# EAGLE schematic Cynara Viride (EAGLE 7.5.0)
BOARD1: PC1200; CDS: © 2015 Sioux Embedded Systems bv, Eindhoven, The Netherlands; DATE1: 010112; REM1: SaSc/initial design; REV1: 1.0

## Sheet 1 of 9: License
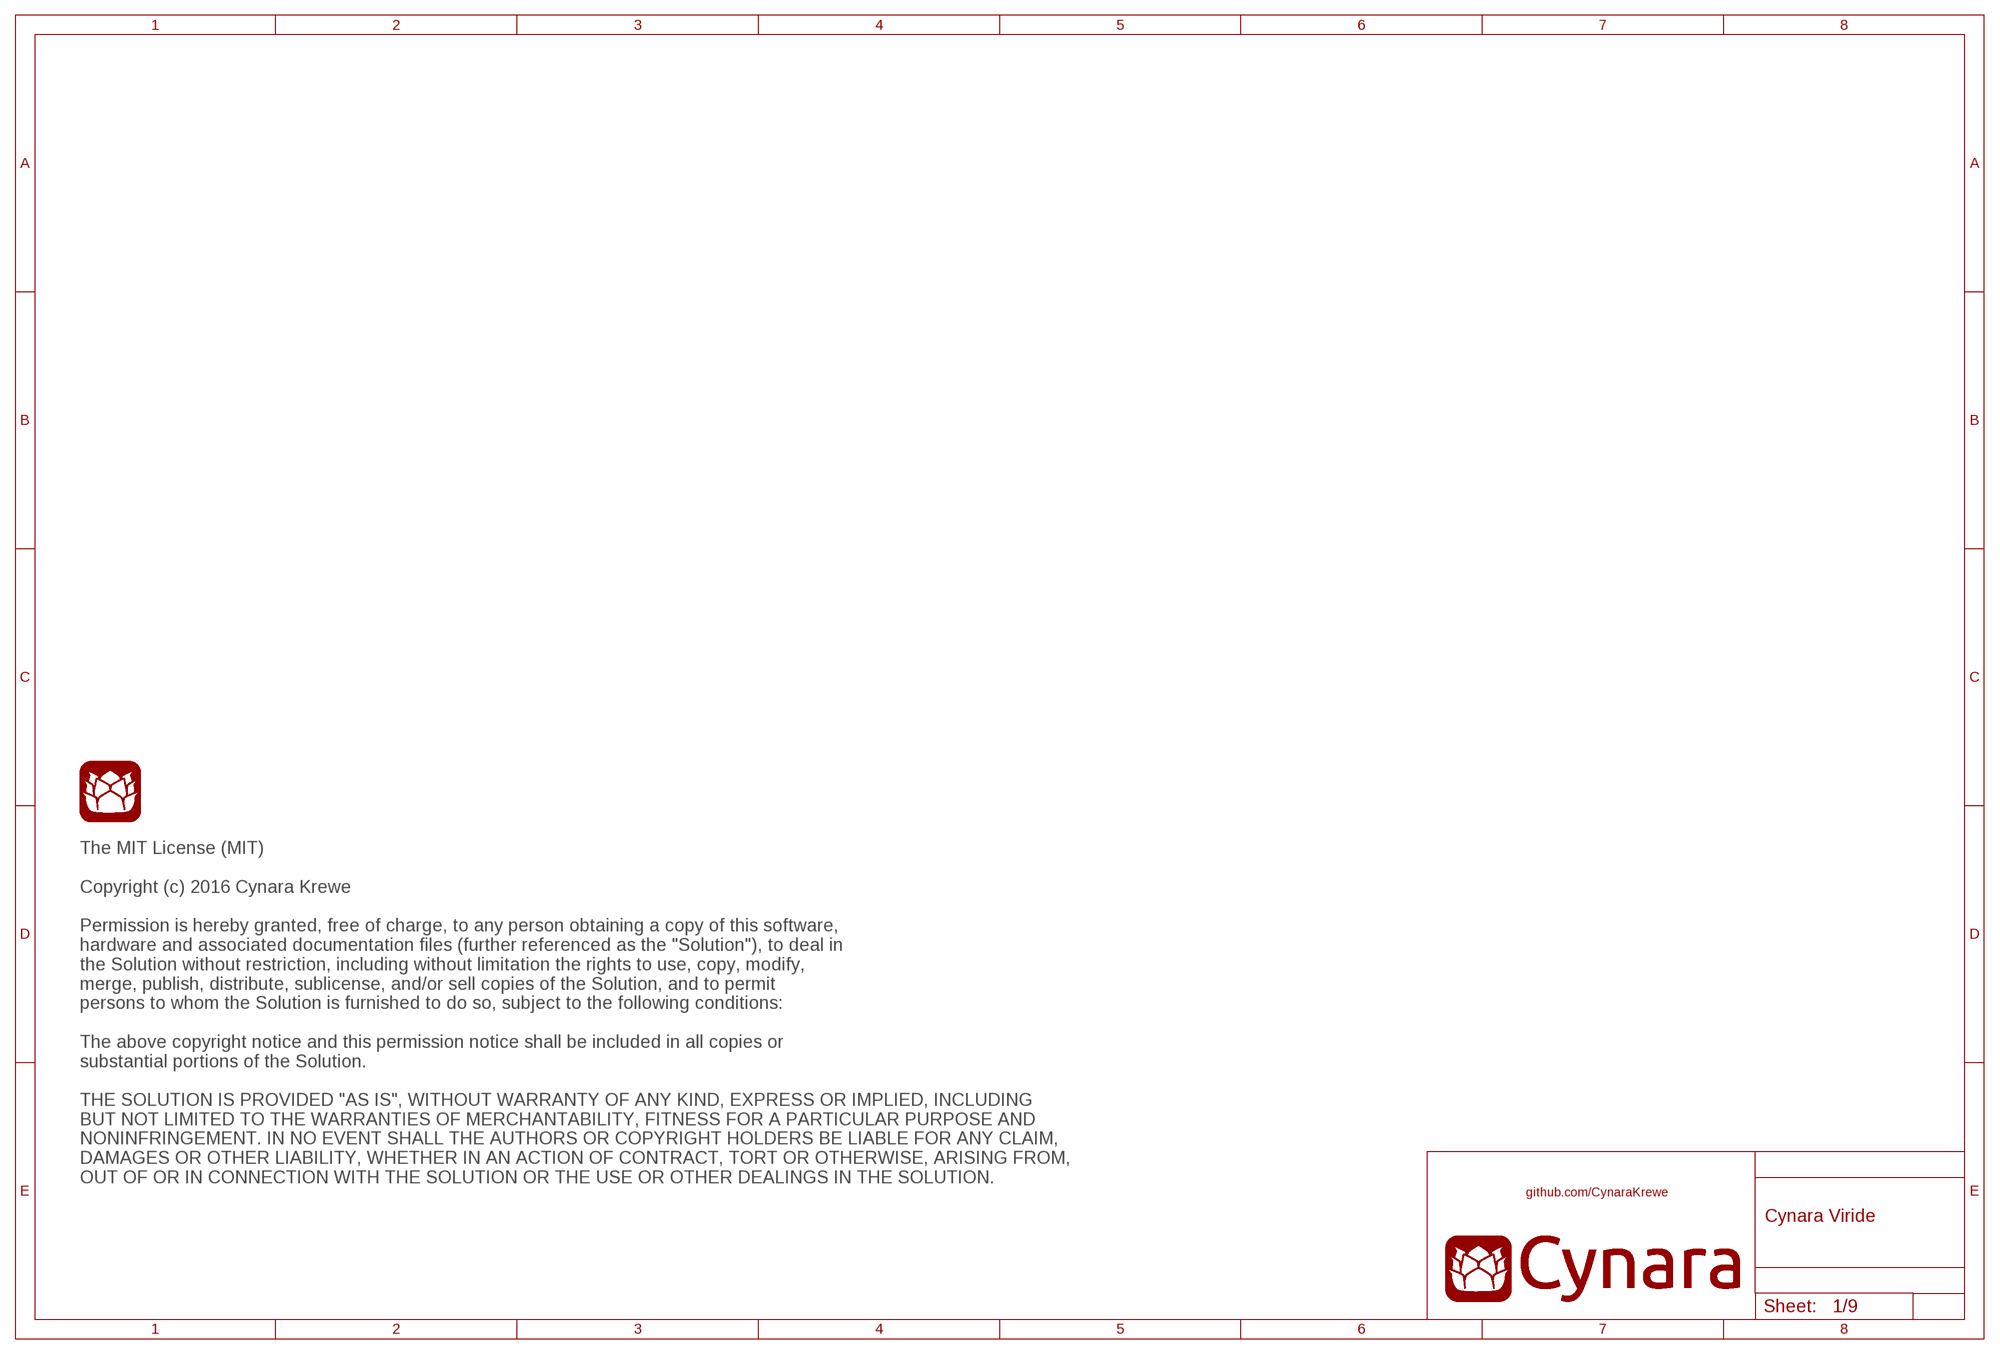
[diagram p0: schematic, sheet 1]

### Parts
U$21  CYNARA_FRONT  [CYNARA_BELOW_W15MM]

### Notes on the sheet
- The MIT License (MIT)
  
  Copyright (c) 2016 Cynara Krewe
  
  Permission is hereby granted, free of charge, to any person obtaining a copy of this software, 
  hardware and associated documentation files (further referenced as the "Solution"), to deal in 
  the Solution without restriction, including without limitation the rights to use, copy, modify, 
  merge, publish, distribute, sublicense, and/or sell copies of the Solution, and to permit 
  persons to whom the Solution is furnished to do so, subject to the following conditions:
  
  The above copyright notice and this permission notice shall be included in all copies or 
  substantial portions of the Solution.
  
  THE SOLUTION IS PROVIDED "AS IS", WITHOUT WARRANTY OF ANY KIND, EXPRESS OR IMPLIED, INCLUDING 
  BUT NOT LIMITED TO THE WARRANTIES OF MERCHANTABILITY, FITNESS FOR A PARTICULAR PURPOSE AND 
  NONINFRINGEMENT. IN NO EVENT SHALL THE AUTHORS OR COPYRIGHT HOLDERS BE LIABLE FOR ANY CLAIM, 
  DAMAGES OR OTHER LIABILITY, WHETHER IN AN ACTION OF CONTRACT, TORT OR OTHERWISE, ARISING FROM, 
  OUT OF OR IN CONNECTION WITH THE SOLUTION OR THE USE OR OTHER DEALINGS IN THE SOLUTION.

## Sheet 2 of 9: MCU: IO pins
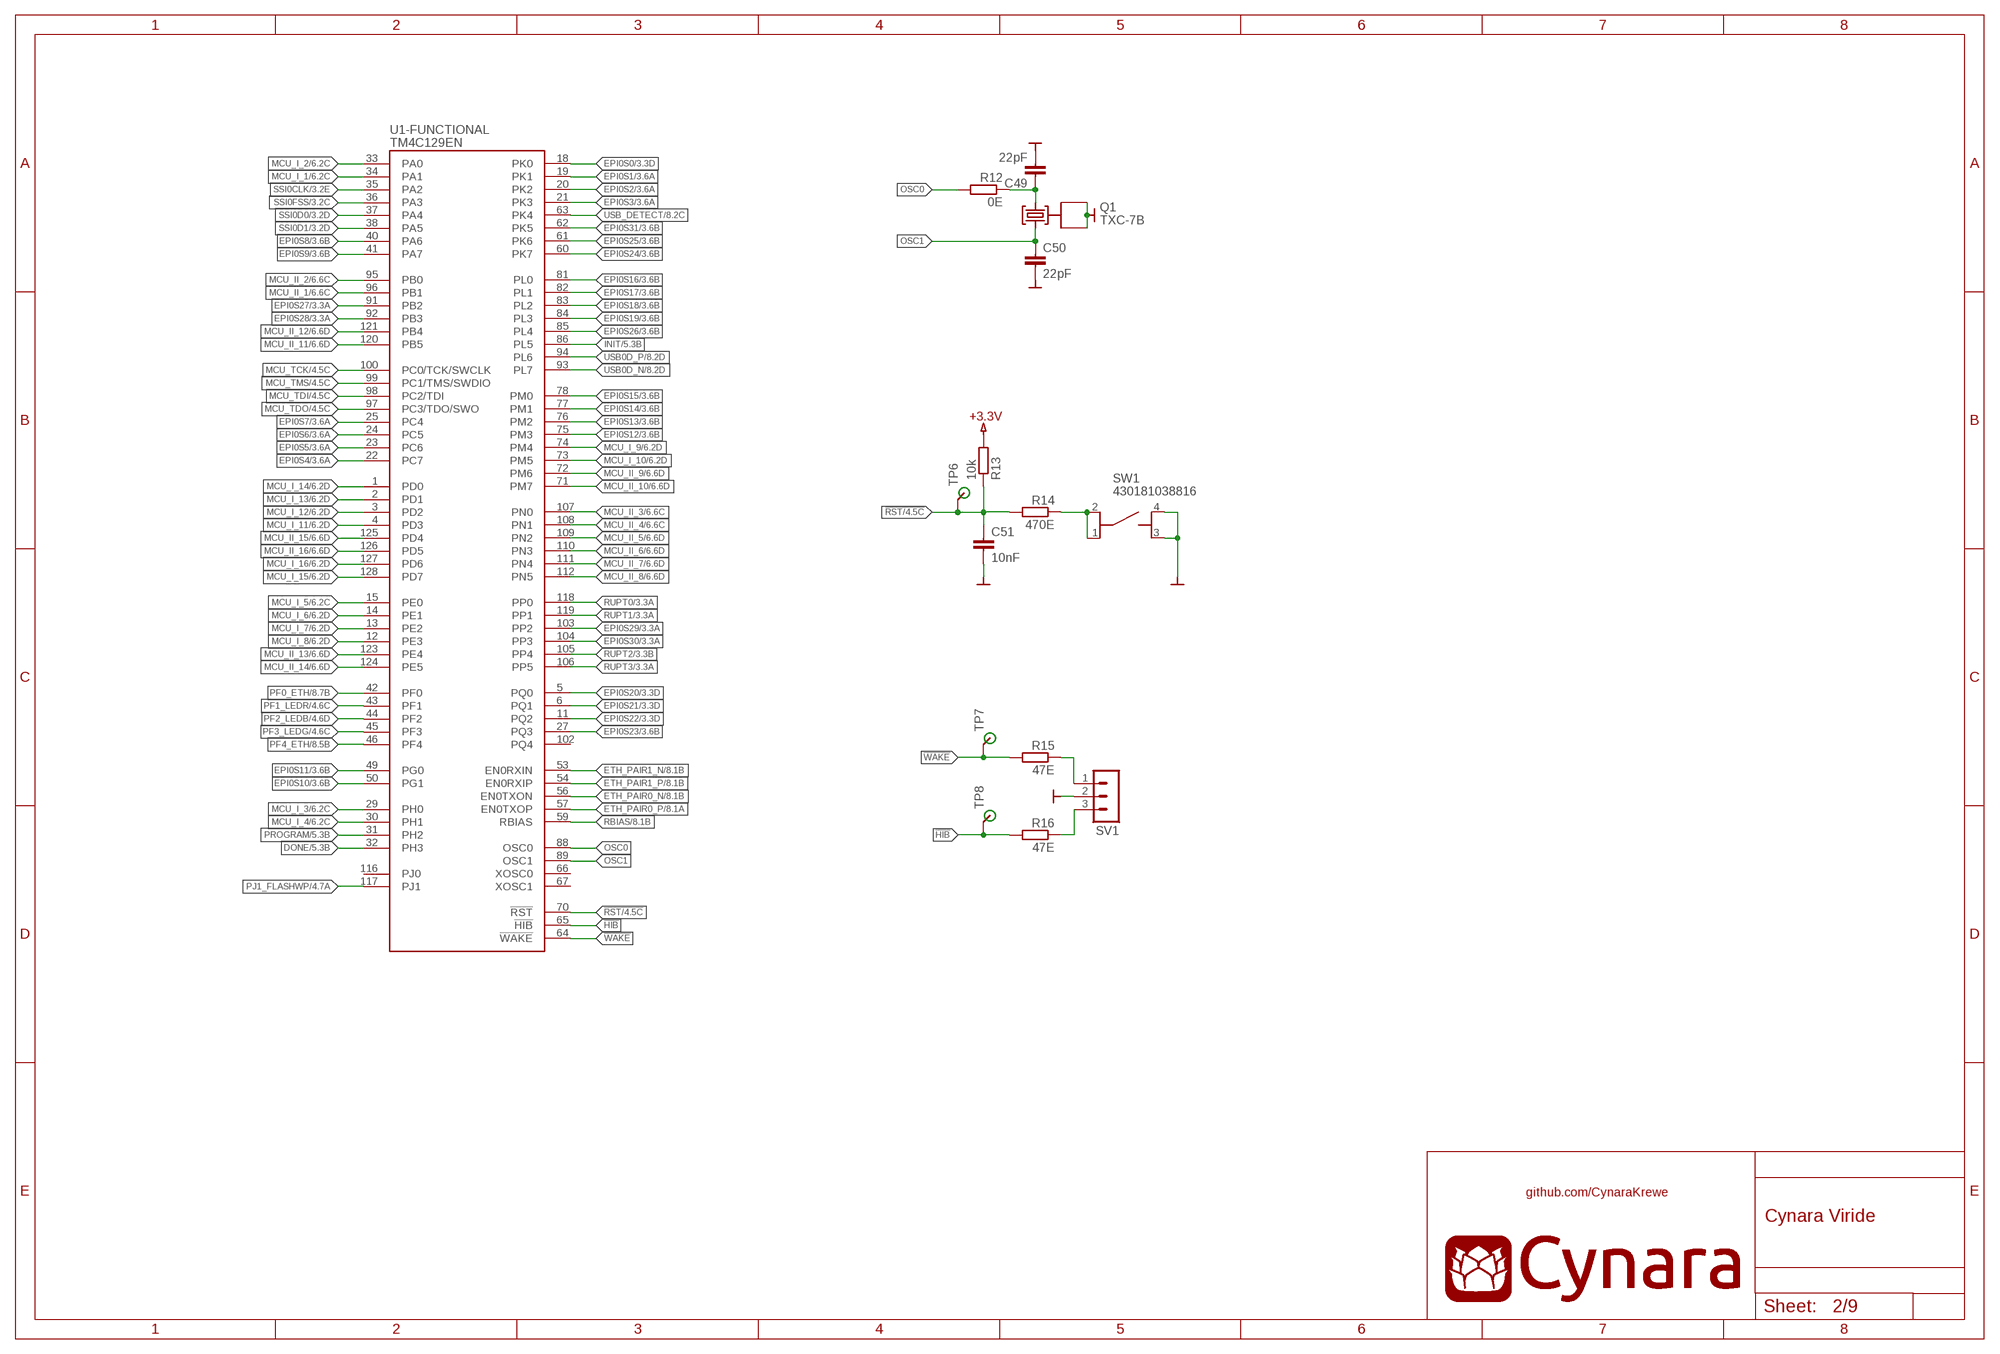
[diagram p1: schematic, sheet 2]

### Parts
C49  22pF  C-EUC0603  [C0603]
C50  22pF  C-EUC0603  [C0603]
C51  10nF  C-EUC0603  [C0603]
Q1  TXC-7B  [TXC-7B]
R12  0E  R-EU_R0603  [R0603]
R13  10k  R-EU_R0603  [R0603]
R14  470E  R-EU_R0603  [R0603]
R15  47E  R-EU_R0603  [R0603]
R16  47E  R-EU_R0603  [R0603]
SV1  MA03-1  [MA03-1]
SW1  430181038816  [430181038816]
TP6  TESTPAD-SMD  [TP-SMD]
TP7  TESTPAD-SMD  [TP-SMD]
TP8  TESTPAD-SMD  [TP-SMD]
U1  TM4C129EN  SPLIT-TM4C129ENCPDT-TQFP128  [S-PQFP-G128]

### Nets
!HIB: R16.2 TP8.1 U1.65(-FUNCTIONAL:!HIB)
!RST: C51.1 R13.1 R14.2 TP6.1 U1.70(-FUNCTIONAL:!RST) ; also sheet 4
!WAKE: R15.2 TP7.1 U1.64(-FUNCTIONAL:!WAKE)
+3.3V: R13.2 ; also sheet 3,4,5,8,9
DONE: U1.32(-FUNCTIONAL:PH3) ; also sheet 5
EPI0S0: U1.18(-FUNCTIONAL:PK0) ; also sheet 3
EPI0S1: U1.19(-FUNCTIONAL:PK1) ; also sheet 3
EPI0S2: U1.20(-FUNCTIONAL:PK2) ; also sheet 3
EPI0S3: U1.21(-FUNCTIONAL:PK3) ; also sheet 3
EPI0S4: U1.22(-FUNCTIONAL:PC7) ; also sheet 3
EPI0S5: U1.23(-FUNCTIONAL:PC6) ; also sheet 3
EPI0S6: U1.24(-FUNCTIONAL:PC5) ; also sheet 3
EPI0S7: U1.25(-FUNCTIONAL:PC4) ; also sheet 3
EPI0S8: U1.40(-FUNCTIONAL:PA6) ; also sheet 3
EPI0S9: U1.41(-FUNCTIONAL:PA7) ; also sheet 3
EPI0S10: U1.50(-FUNCTIONAL:PG1) ; also sheet 3
EPI0S11: U1.49(-FUNCTIONAL:PG0) ; also sheet 3
EPI0S12: U1.75(-FUNCTIONAL:PM3) ; also sheet 3
EPI0S13: U1.76(-FUNCTIONAL:PM2) ; also sheet 3
EPI0S14: U1.77(-FUNCTIONAL:PM1) ; also sheet 3
EPI0S15: U1.78(-FUNCTIONAL:PM0) ; also sheet 3
EPI0S16: U1.81(-FUNCTIONAL:PL0) ; also sheet 3
EPI0S17: U1.82(-FUNCTIONAL:PL1) ; also sheet 3
EPI0S18: U1.83(-FUNCTIONAL:PL2) ; also sheet 3
EPI0S19: U1.84(-FUNCTIONAL:PL3) ; also sheet 3
EPI0S20: U1.5(-FUNCTIONAL:PQ0) ; also sheet 3
EPI0S21: U1.6(-FUNCTIONAL:PQ1) ; also sheet 3
EPI0S22: U1.11(-FUNCTIONAL:PQ2) ; also sheet 3
EPI0S23: U1.27(-FUNCTIONAL:PQ3) ; also sheet 3
EPI0S24: U1.60(-FUNCTIONAL:PK7) ; also sheet 3
EPI0S25: U1.61(-FUNCTIONAL:PK6) ; also sheet 3
EPI0S26: U1.85(-FUNCTIONAL:PL4) ; also sheet 3
EPI0S27: U1.91(-FUNCTIONAL:PB2) ; also sheet 3
EPI0S28: U1.92(-FUNCTIONAL:PB3) ; also sheet 3
EPI0S29: U1.103(-FUNCTIONAL:PP2) ; also sheet 3
EPI0S30: U1.104(-FUNCTIONAL:PP3) ; also sheet 3
EPI0S31: U1.62(-FUNCTIONAL:PK5) ; also sheet 3
ETH_PAIR0_N: U1.56(-FUNCTIONAL:EN0TXON) ; also sheet 8
ETH_PAIR0_P: U1.57(-FUNCTIONAL:EN0TXOP) ; also sheet 8
ETH_PAIR1_N: U1.53(-FUNCTIONAL:EN0RXIN) ; also sheet 8
ETH_PAIR1_P: U1.54(-FUNCTIONAL:EN0RXIP) ; also sheet 8
GND: C49.2 C50.2 C51.2 Q1.2(GND) Q1.4(GND) SV1.2 SW1.3 SW1.4 ; also sheet 3,4,5,6,7,8,9
INIT: U1.86(-FUNCTIONAL:PL5) ; also sheet 5
MCU_I_1: U1.34(-FUNCTIONAL:PA1) ; also sheet 6
MCU_I_2: U1.33(-FUNCTIONAL:PA0) ; also sheet 6
MCU_I_3: U1.29(-FUNCTIONAL:PH0) ; also sheet 6
MCU_I_4: U1.30(-FUNCTIONAL:PH1) ; also sheet 6
MCU_I_5: U1.15(-FUNCTIONAL:PE0) ; also sheet 6
MCU_I_6: U1.14(-FUNCTIONAL:PE1) ; also sheet 6
MCU_I_7: U1.13(-FUNCTIONAL:PE2) ; also sheet 6
MCU_I_8: U1.12(-FUNCTIONAL:PE3) ; also sheet 6
MCU_I_9: U1.74(-FUNCTIONAL:PM4) ; also sheet 6
MCU_I_10: U1.73(-FUNCTIONAL:PM5) ; also sheet 6
MCU_I_11: U1.4(-FUNCTIONAL:PD3) ; also sheet 6
MCU_I_12: U1.3(-FUNCTIONAL:PD2) ; also sheet 6
MCU_I_13: U1.2(-FUNCTIONAL:PD1) ; also sheet 6
MCU_I_14: U1.1(-FUNCTIONAL:PD0) ; also sheet 6
MCU_I_15: U1.128(-FUNCTIONAL:PD7) ; also sheet 6
MCU_I_16: U1.127(-FUNCTIONAL:PD6) ; also sheet 6
MCU_II_1: U1.96(-FUNCTIONAL:PB1) ; also sheet 6
MCU_II_2: U1.95(-FUNCTIONAL:PB0) ; also sheet 6
MCU_II_3: U1.107(-FUNCTIONAL:PN0) ; also sheet 6
MCU_II_4: U1.108(-FUNCTIONAL:PN1) ; also sheet 6
MCU_II_5: U1.109(-FUNCTIONAL:PN2) ; also sheet 6
MCU_II_6: U1.110(-FUNCTIONAL:PN3) ; also sheet 6
MCU_II_7: U1.111(-FUNCTIONAL:PN4) ; also sheet 6
MCU_II_8: U1.112(-FUNCTIONAL:PN5) ; also sheet 6
MCU_II_9: U1.72(-FUNCTIONAL:PM6) ; also sheet 6
MCU_II_10: U1.71(-FUNCTIONAL:PM7) ; also sheet 6
MCU_II_11: U1.120(-FUNCTIONAL:PB5) ; also sheet 6
MCU_II_12: U1.121(-FUNCTIONAL:PB4) ; also sheet 6
MCU_II_13: U1.123(-FUNCTIONAL:PE4) ; also sheet 6
MCU_II_14: U1.124(-FUNCTIONAL:PE5) ; also sheet 6
MCU_II_15: U1.125(-FUNCTIONAL:PD4) ; also sheet 6
MCU_II_16: U1.126(-FUNCTIONAL:PD5) ; also sheet 6
MCU_TCK: U1.100(-FUNCTIONAL:PC0/TCK/SWCLK) ; also sheet 4
MCU_TDI: U1.98(-FUNCTIONAL:PC2/TDI) ; also sheet 4
MCU_TDO: U1.97(-FUNCTIONAL:PC3/TDO/SWO) ; also sheet 4
MCU_TMS: U1.99(-FUNCTIONAL:PC1/TMS/SWDIO) ; also sheet 4
N$8: R15.1 SV1.1
N$9: C49.1 Q1.1(XTALA) R12.1
N$11: R14.1 SW1.1 SW1.2
N$45: R16.1 SV1.3
OSC0: R12.2 U1.88(-FUNCTIONAL:OSC0)
OSC1: C50.1 Q1.3(XTALB) U1.89(-FUNCTIONAL:OSC1)
PF0_ETH: U1.42(-FUNCTIONAL:PF0) ; also sheet 8
PF1_LEDR: U1.43(-FUNCTIONAL:PF1) ; also sheet 4
PF2_LEDB: U1.44(-FUNCTIONAL:PF2) ; also sheet 4
PF3_LEDG: U1.45(-FUNCTIONAL:PF3) ; also sheet 4
PF4_ETH: U1.46(-FUNCTIONAL:PF4) ; also sheet 8
PJ1_FLASHWP: U1.117(-FUNCTIONAL:PJ1) ; also sheet 4
PROGRAM: U1.31(-FUNCTIONAL:PH2) ; also sheet 5
RBIAS: U1.59(-FUNCTIONAL:RBIAS) ; also sheet 8
RUPT0: U1.118(-FUNCTIONAL:PP0) ; also sheet 3
RUPT1: U1.119(-FUNCTIONAL:PP1) ; also sheet 3
RUPT2: U1.105(-FUNCTIONAL:PP4) ; also sheet 3
RUPT3: U1.106(-FUNCTIONAL:PP5) ; also sheet 3
SSI0CLK: U1.35(-FUNCTIONAL:PA2) ; also sheet 3,4
SSI0D0: U1.37(-FUNCTIONAL:PA4) ; also sheet 3,4
SSI0D1: U1.38(-FUNCTIONAL:PA5) ; also sheet 3,4
SSI0FSS: U1.36(-FUNCTIONAL:PA3) ; also sheet 3,4
USB0D_N: U1.93(-FUNCTIONAL:PL7) ; also sheet 8
USB0D_P: U1.94(-FUNCTIONAL:PL6) ; also sheet 8
USB_DETECT: U1.63(-FUNCTIONAL:PK4) ; also sheet 8
Unconnected: U1.66(-FUNCTIONAL:XOSC0) U1.67(-FUNCTIONAL:XOSC1) U1.102(-FUNCTIONAL:PQ4) U1.116(-FUNCTIONAL:PJ0)

## Sheet 3 of 9: FPGA IO pins
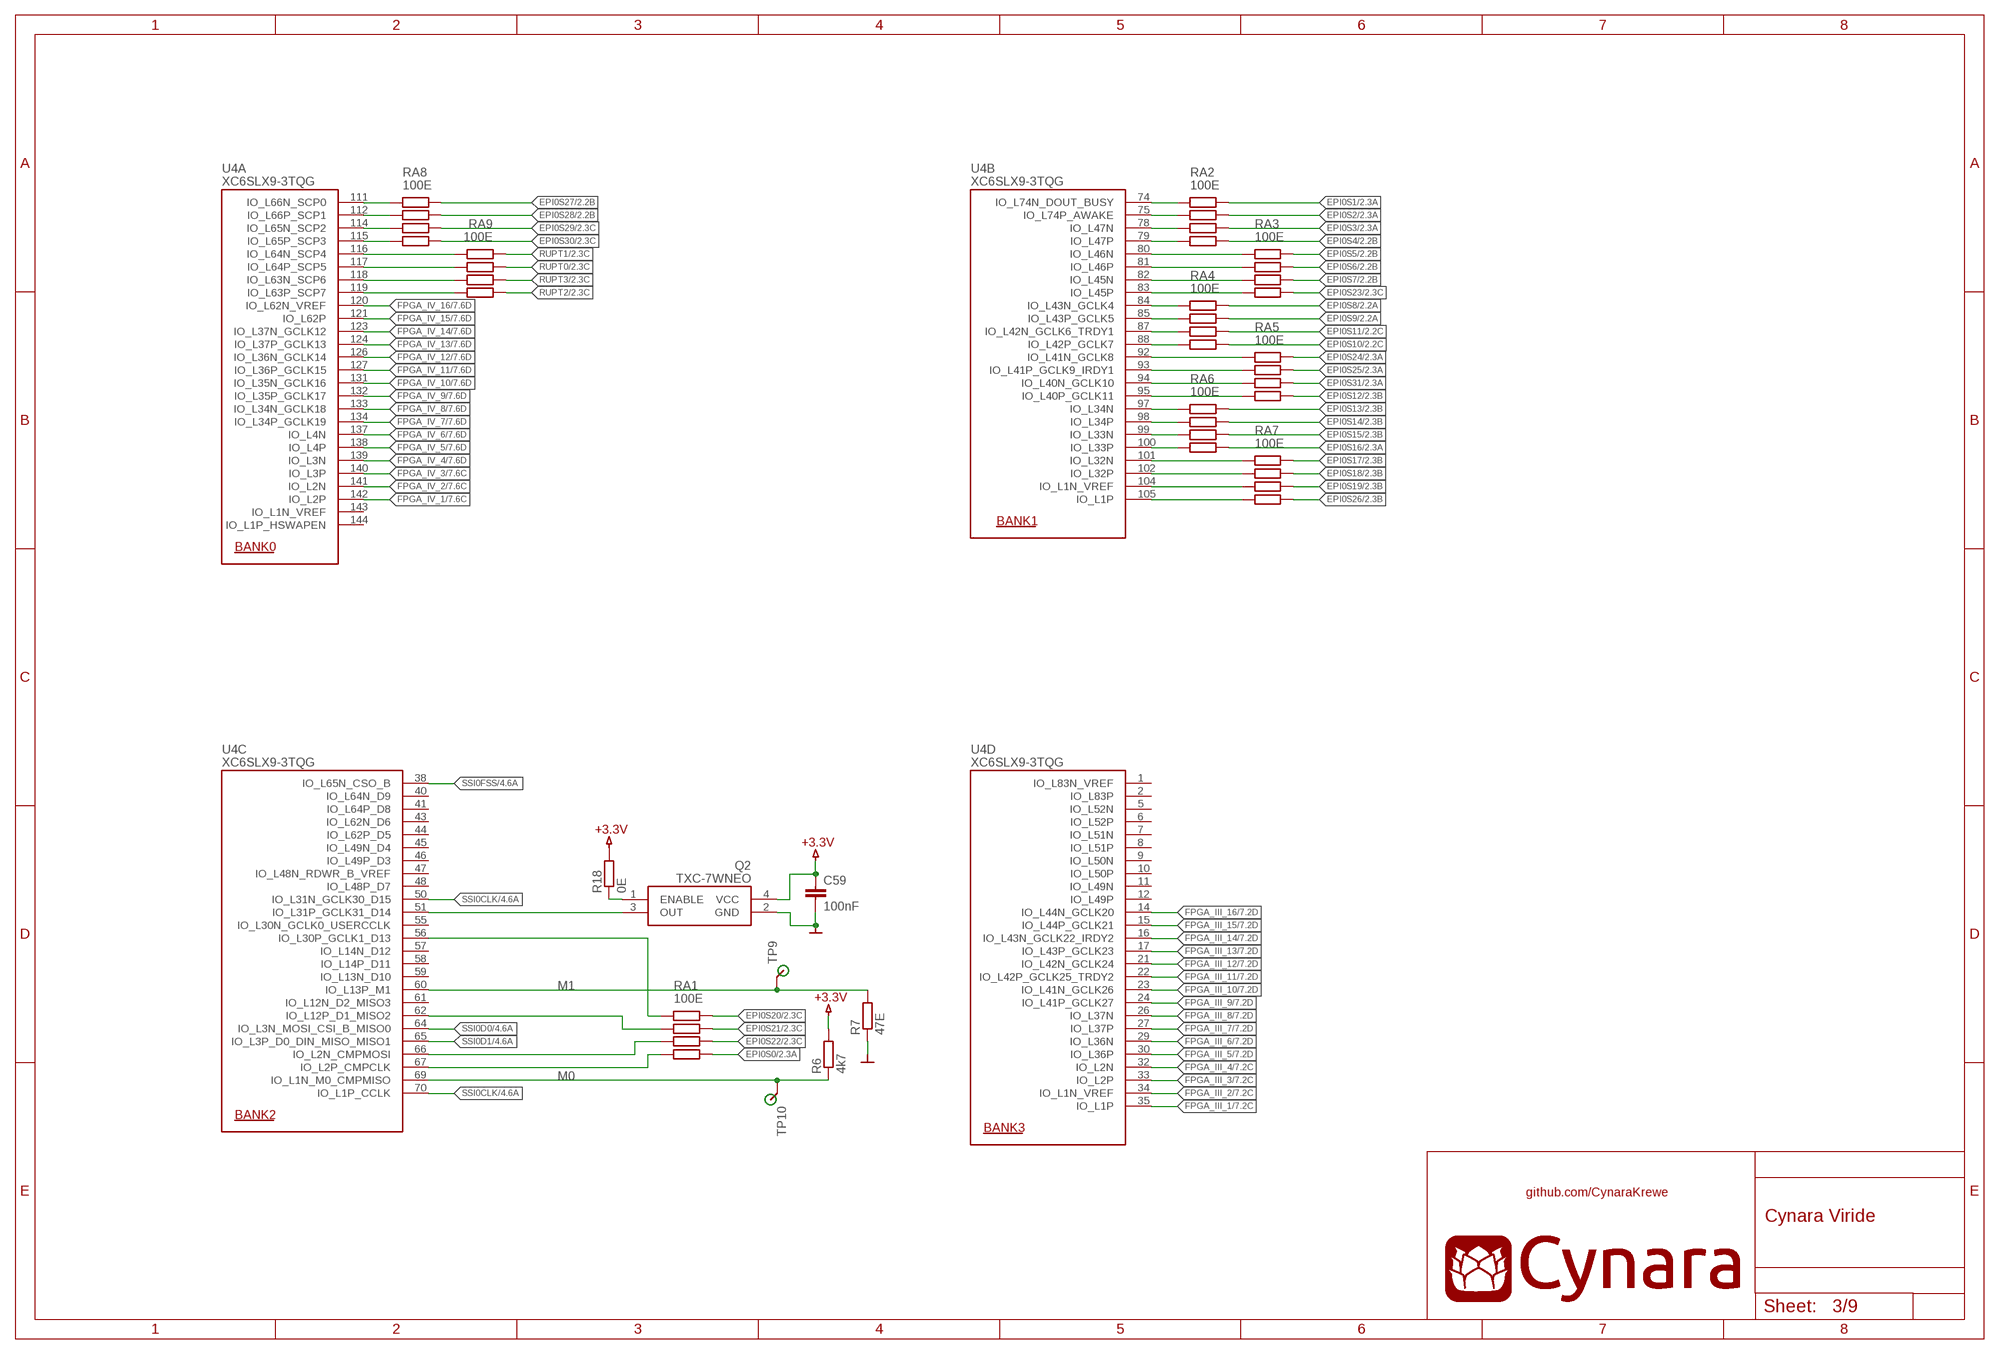
[diagram p2: schematic, sheet 3]

### Parts
C59  100nF  C-EUC0603  [C0603]
Q2  TXC-7WNEO  [TXC-7W]
R6  4k7  R-EU_R0603  [R0603]
R7  47E  R-EU_R0603  [R0603]
R18  0E  R-EU_R0603  [R0603]
RA1  100E  RES-ARRAY-100E-4X  [CRA06S]
RA2  100E  RES-ARRAY-100E-4X  [CRA06S]
RA3  100E  RES-ARRAY-100E-4X  [CRA06S]
RA4  100E  RES-ARRAY-100E-4X  [CRA06S]
RA5  100E  RES-ARRAY-100E-4X  [CRA06S]
RA6  100E  RES-ARRAY-100E-4X  [CRA06S]
RA7  100E  RES-ARRAY-100E-4X  [CRA06S]
RA8  100E  RES-ARRAY-100E-4X  [CRA06S]
RA9  100E  RES-ARRAY-100E-4X  [CRA06S]
TP9  TESTPAD-SMD  [TP-SMD]
TP10  TESTPAD-SMD  [TP-SMD]
U4  XC6SLX9-3TQG  XC6SLX9-3TQG144C  [TQG144]

### Nets
+3.3V: C59.1 Q2.4(VCC) R6.2 R18.2 ; also sheet 2,4,5,8,9
EPI0S0: RA1.4B ; also sheet 2
EPI0S1: RA2.1B ; also sheet 2
EPI0S2: RA2.2B ; also sheet 2
EPI0S3: RA2.3B ; also sheet 2
EPI0S4: RA2.4B ; also sheet 2
EPI0S5: RA3.1B ; also sheet 2
EPI0S6: RA3.2B ; also sheet 2
EPI0S7: RA3.3B ; also sheet 2
EPI0S8: RA4.1B ; also sheet 2
EPI0S9: RA4.2B ; also sheet 2
EPI0S10: RA4.4B ; also sheet 2
EPI0S11: RA4.3B ; also sheet 2
EPI0S12: RA5.4B ; also sheet 2
EPI0S13: RA6.1B ; also sheet 2
EPI0S14: RA6.2B ; also sheet 2
EPI0S15: RA6.3B ; also sheet 2
EPI0S16: RA6.4B ; also sheet 2
EPI0S17: RA7.1B ; also sheet 2
EPI0S18: RA7.2B ; also sheet 2
EPI0S19: RA7.3B ; also sheet 2
EPI0S20: RA1.1B ; also sheet 2
EPI0S21: RA1.2B ; also sheet 2
EPI0S22: RA1.3B ; also sheet 2
EPI0S23: RA3.4B ; also sheet 2
EPI0S24: RA5.1B ; also sheet 2
EPI0S25: RA5.2B ; also sheet 2
EPI0S26: RA7.4B ; also sheet 2
EPI0S27: RA8.1B ; also sheet 2
EPI0S28: RA8.2B ; also sheet 2
EPI0S29: RA8.3B ; also sheet 2
EPI0S30: RA8.4B ; also sheet 2
EPI0S31: RA5.3B ; also sheet 2
FPGA_EPI0S0: RA1.4A U4.67(C:IO_L2P_CMPCLK)
FPGA_EPI0S1: RA2.1A U4.74(B:IO_L74N_DOUT_BUSY)
FPGA_EPI0S2: RA2.2A U4.75(B:IO_L74P_AWAKE)
FPGA_EPI0S3: RA2.3A U4.78(B:IO_L47N)
FPGA_EPI0S4: RA2.4A U4.79(B:IO_L47P)
FPGA_EPI0S5: RA3.1A U4.80(B:IO_L46N)
FPGA_EPI0S6: RA3.2A U4.81(B:IO_L46P)
FPGA_EPI0S7: RA3.3A U4.82(B:IO_L45N)
FPGA_EPI0S8: RA4.1A U4.84(B:IO_L43N_GCLK4)
FPGA_EPI0S9: RA4.2A U4.85(B:IO_L43P_GCLK5)
FPGA_EPI0S10: RA4.4A U4.88(B:IO_L42P_GCLK7)
FPGA_EPI0S11: RA4.3A U4.87(B:IO_L42N_GCLK6_TRDY1)
FPGA_EPI0S12: RA5.4A U4.95(B:IO_L40P_GCLK11)
FPGA_EPI0S13: RA6.1A U4.97(B:IO_L34N)
FPGA_EPI0S14: RA6.2A U4.98(B:IO_L34P)
FPGA_EPI0S15: RA6.3A U4.99(B:IO_L33N)
FPGA_EPI0S16: RA6.4A U4.100(B:IO_L33P)
FPGA_EPI0S17: RA7.1A U4.101(B:IO_L32N)
FPGA_EPI0S18: RA7.2A U4.102(B:IO_L32P)
FPGA_EPI0S19: RA7.3A U4.104(B:IO_L1N_VREF)
FPGA_EPI0S20: RA1.1A U4.56(C:IO_L30P_GCLK1_D13)
FPGA_EPI0S21: RA1.2A U4.62(C:IO_L12P_D1_MISO2)
FPGA_EPI0S22: RA1.3A U4.66(C:IO_L2N_CMPMOSI)
FPGA_EPI0S23: RA3.4A U4.83(B:IO_L45P)
FPGA_EPI0S24: RA5.1A U4.92(B:IO_L41N_GCLK8)
FPGA_EPI0S25: RA5.2A U4.93(B:IO_L41P_GCLK9_IRDY1)
FPGA_EPI0S26: RA7.4A U4.105(B:IO_L1P)
FPGA_EPI0S27: RA8.1A U4.111(A:IO_L66N_SCP0)
FPGA_EPI0S28: RA8.2A U4.112(A:IO_L66P_SCP1)
FPGA_EPI0S29: RA8.3A U4.114(A:IO_L65N_SCP2)
FPGA_EPI0S30: RA8.4A U4.115(A:IO_L65P_SCP3)
FPGA_EPI0S31: RA5.3A U4.94(B:IO_L40N_GCLK10)
FPGA_III_1: U4.35(D:IO_L1P) ; also sheet 7
FPGA_III_2: U4.34(D:IO_L1N_VREF) ; also sheet 7
FPGA_III_3: U4.33(D:IO_L2P) ; also sheet 7
FPGA_III_4: U4.32(D:IO_L2N) ; also sheet 7
FPGA_III_5: U4.30(D:IO_L36P) ; also sheet 7
FPGA_III_6: U4.29(D:IO_L36N) ; also sheet 7
FPGA_III_7: U4.27(D:IO_L37P) ; also sheet 7
FPGA_III_8: U4.26(D:IO_L37N) ; also sheet 7
FPGA_III_9: U4.24(D:IO_L41P_GCLK27) ; also sheet 7
FPGA_III_10: U4.23(D:IO_L41N_GCLK26) ; also sheet 7
FPGA_III_11: U4.22(D:IO_L42P_GCLK25_TRDY2) ; also sheet 7
FPGA_III_12: U4.21(D:IO_L42N_GCLK24) ; also sheet 7
FPGA_III_13: U4.17(D:IO_L43P_GCLK23) ; also sheet 7
FPGA_III_14: U4.16(D:IO_L43N_GCLK22_IRDY2) ; also sheet 7
FPGA_III_15: U4.15(D:IO_L44P_GCLK21) ; also sheet 7
FPGA_III_16: U4.14(D:IO_L44N_GCLK20) ; also sheet 7
FPGA_IV_1: U4.142(A:IO_L2P) ; also sheet 7
FPGA_IV_2: U4.141(A:IO_L2N) ; also sheet 7
FPGA_IV_3: U4.140(A:IO_L3P) ; also sheet 7
FPGA_IV_4: U4.139(A:IO_L3N) ; also sheet 7
FPGA_IV_5: U4.138(A:IO_L4P) ; also sheet 7
FPGA_IV_6: U4.137(A:IO_L4N) ; also sheet 7
FPGA_IV_7: U4.134(A:IO_L34P_GCLK19) ; also sheet 7
FPGA_IV_8: U4.133(A:IO_L34N_GCLK18) ; also sheet 7
FPGA_IV_9: U4.132(A:IO_L35P_GCLK17) ; also sheet 7
FPGA_IV_10: U4.131(A:IO_L35N_GCLK16) ; also sheet 7
FPGA_IV_11: U4.127(A:IO_L36P_GCLK15) ; also sheet 7
FPGA_IV_12: U4.126(A:IO_L36N_GCLK14) ; also sheet 7
FPGA_IV_13: U4.124(A:IO_L37P_GCLK13) ; also sheet 7
FPGA_IV_14: U4.123(A:IO_L37N_GCLK12) ; also sheet 7
FPGA_IV_15: U4.121(A:IO_L62P) ; also sheet 7
FPGA_IV_16: U4.120(A:IO_L62N_VREF) ; also sheet 7
FPGA_OSC: Q2.3(OUT) U4.51(C:IO_L31P_GCLK31_D14)
FPGA_RUPT0: RA9.2B U4.117(A:IO_L64P_SCP5)
FPGA_RUPT1: RA9.1B U4.116(A:IO_L64N_SCP4)
FPGA_RUPT2: RA9.4B U4.119(A:IO_L63P_SCP7)
FPGA_RUPT3: RA9.3B U4.118(A:IO_L63N_SCP6)
GND: C59.2 Q2.2(GND) R7.1 ; also sheet 2,4,5,6,7,8,9
M0: R6.1 TP10.1 U4.69(C:IO_L1N_M0_CMPMISO)
M1: R7.2 TP9.1 U4.60(C:IO_L13P_M1)
N$72: Q2.1(ENABLE) R18.1
RUPT0: RA9.2A ; also sheet 2
RUPT1: RA9.1A ; also sheet 2
RUPT2: RA9.4A ; also sheet 2
RUPT3: RA9.3A ; also sheet 2
SSI0CLK: U4.50(C:IO_L31N_GCLK30_D15) U4.70(C:IO_L1P_CCLK) ; also sheet 2,4
SSI0D0: U4.64(C:IO_L3N_MOSI_CSI_B_MISO0) ; also sheet 2,4
SSI0D1: U4.65(C:IO_L3P_D0_DIN_MISO_MISO1) ; also sheet 2,4
SSI0FSS: U4.38(C:IO_L65N_CSO_B) ; also sheet 2,4
Unconnected: U4.1(D:IO_L83N_VREF) U4.2(D:IO_L83P) U4.5(D:IO_L52N) U4.6(D:IO_L52P) U4.7(D:IO_L51N) U4.8(D:IO_L51P) U4.9(D:IO_L50N) U4.10(D:IO_L50P) U4.11(D:IO_L49N) U4.12(D:IO_L49P) U4.40(C:IO_L64N_D9) U4.41(C:IO_L64P_D8) U4.43(C:IO_L62N_D6) U4.44(C:IO_L62P_D5) U4.45(C:IO_L49N_D4) U4.46(C:IO_L49P_D3) U4.47(C:IO_L48N_RDWR_B_VREF) U4.48(C:IO_L48P_D7) U4.55(C:IO_L30N_GCLK0_USERCCLK) U4.57(C:IO_L14N_D12) U4.58(C:IO_L14P_D11) U4.59(C:IO_L13N_D10) U4.61(C:IO_L12N_D2_MISO3) U4.143(A:IO_L1N_VREF) U4.144(A:IO_L1P_HSWAPEN)

## Sheet 4 of 9: MCU: Programming and power
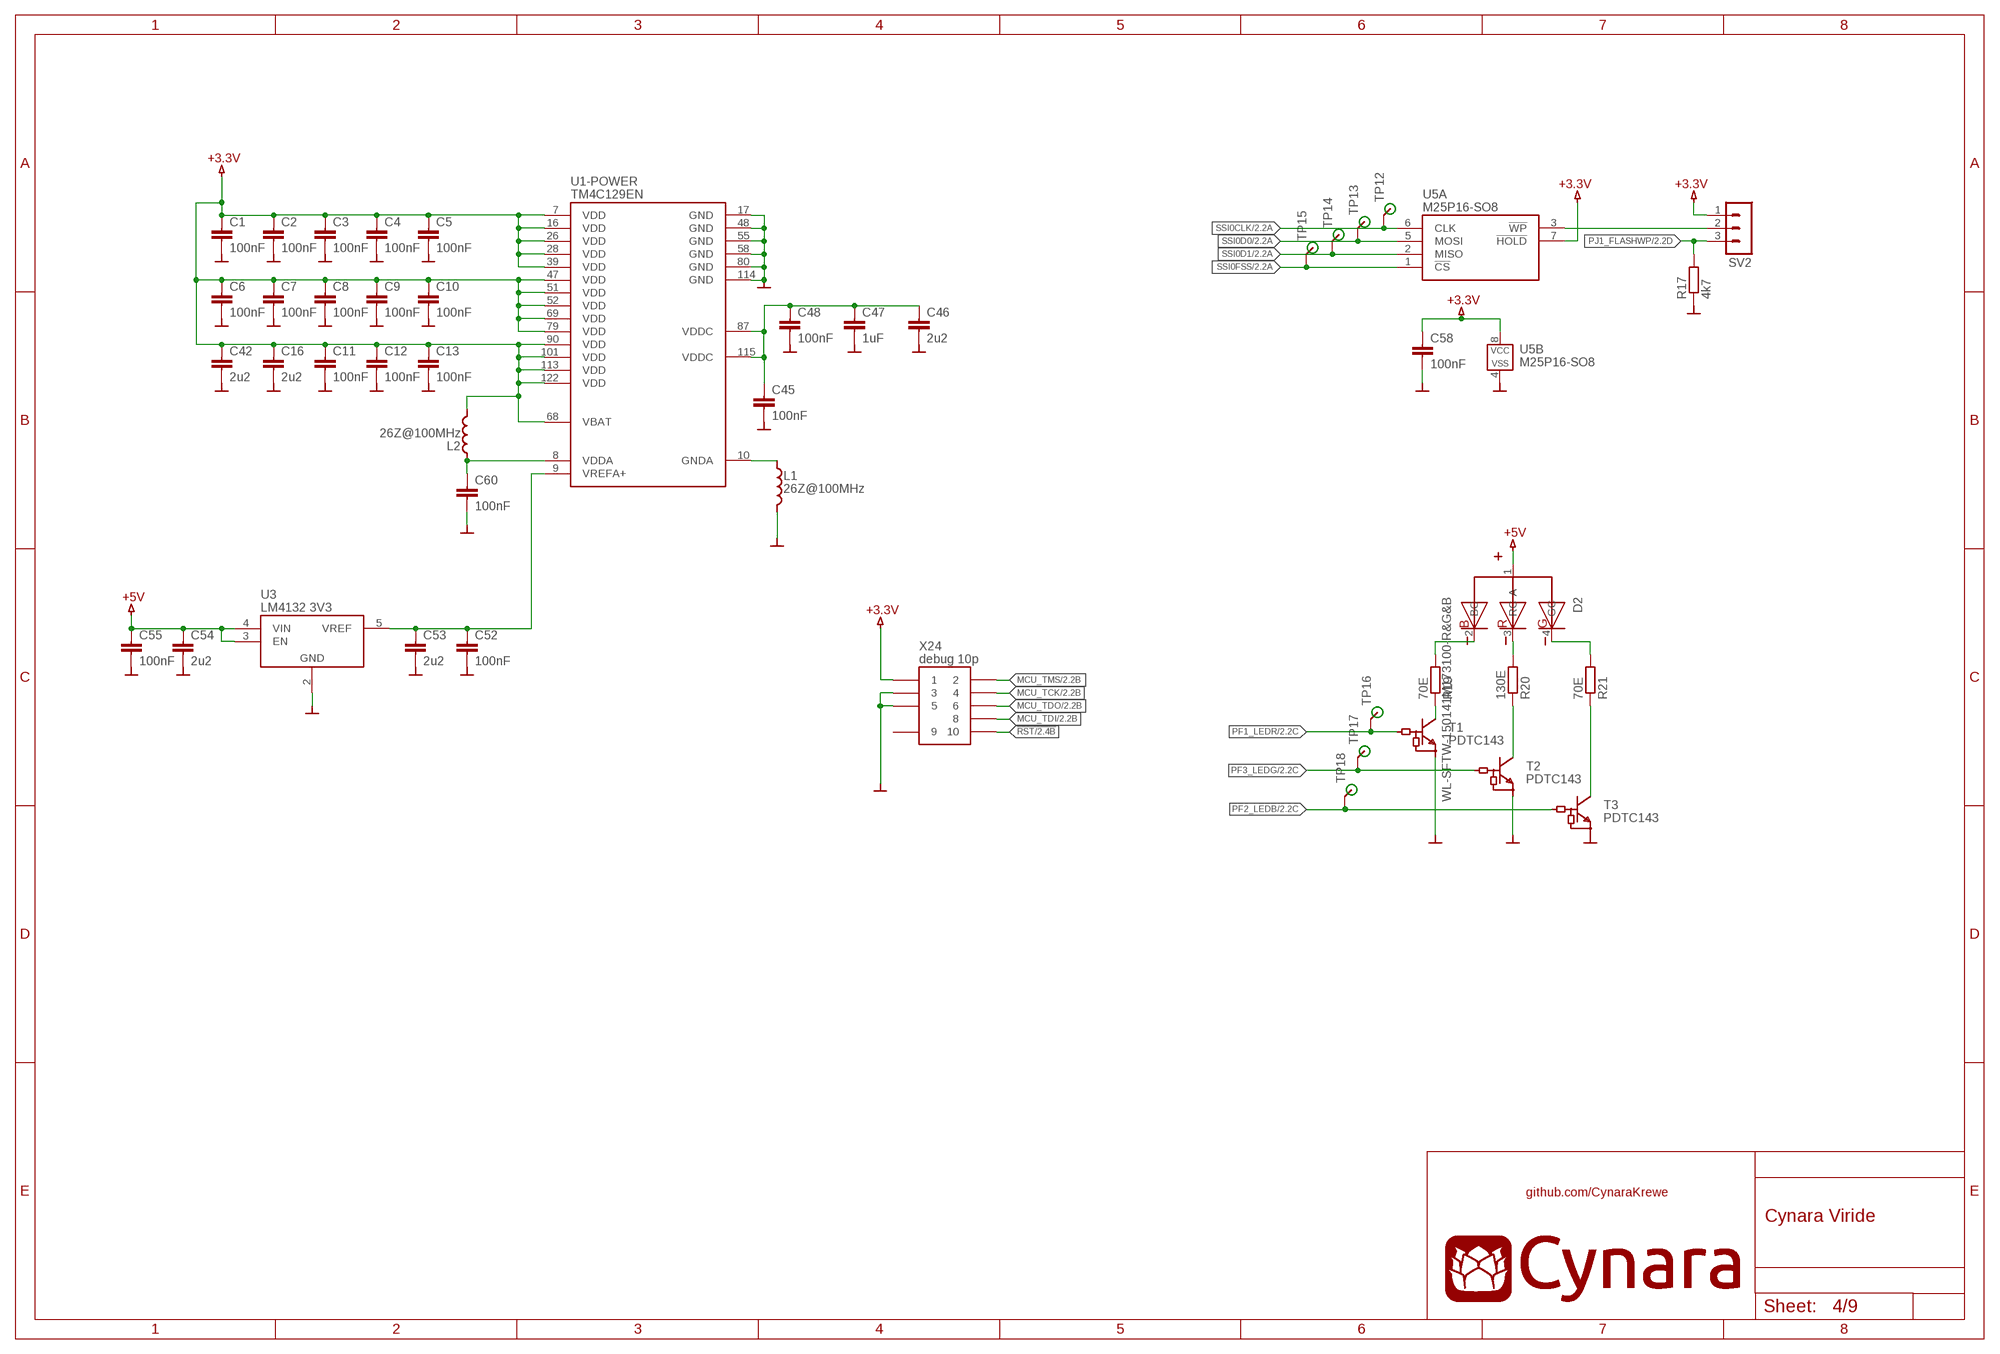
[diagram p3: schematic, sheet 4]

### Parts
C1  100nF  C-EUC0603  [C0603]
C2  100nF  C-EUC0603  [C0603]
C3  100nF  C-EUC0603  [C0603]
C4  100nF  C-EUC0603  [C0603]
C5  100nF  C-EUC0603  [C0603]
C6  100nF  C-EUC0603  [C0603]
C7  100nF  C-EUC0603  [C0603]
C8  100nF  C-EUC0603  [C0603]
C9  100nF  C-EUC0603  [C0603]
C10  100nF  C-EUC0603  [C0603]
C11  100nF  C-EUC0603  [C0603]
C12  100nF  C-EUC0603  [C0603]
C13  100nF  C-EUC0603  [C0603]
C16  2u2  C-EUC0603  [C0603]
C42  2u2  C-EUC0603  [C0603]
C45  100nF  C-EUC0603  [C0603]
C46  2u2  C-EUC0603  [C0603]
C47  1uF  C-EUC0603  [C0603]
C48  100nF  C-EUC0603  [C0603]
C52  100nF  C-EUC0603  [C0603]
C53  2u2  C-EUC0603  [C0603]
C54  2u2  C-EUC0603  [C0603]
C55  100nF  C-EUC0603  [C0603]
C58  100nF  C-EUC0603  [C0603]
C60  100nF  C-EUC0603  [C0603]
D2  WL-SFTW-150141M173100-R&G&B  [3528-COMMON-ANODE]
L1  26Z@100MHz  BEAD_26Z@100MHZ[0603]  [L1608]
L2  26Z@100MHz  BEAD_26Z@100MHZ[0603]  [L1608]
R17  4k7  R-EU_R0603  [R0603]
R19  70E  R-EU_R0603  [R0603]
R20  130E  R-EU_R0603  [R0603]
R21  70E  R-EU_R0603  [R0603]
SV2  MA03-1  [MA03-1]
T1  PDTC143  DIGITAL_TRANSISTOR4K7  [SOT23-3]
T2  PDTC143  DIGITAL_TRANSISTOR4K7  [SOT23-3]
T3  PDTC143  DIGITAL_TRANSISTOR4K7  [SOT23-3]
TP12  TESTPAD-SMD  [TP-SMD]
TP13  TESTPAD-SMD  [TP-SMD]
TP14  TESTPAD-SMD  [TP-SMD]
TP15  TESTPAD-SMD  [TP-SMD]
TP16  TESTPAD-SMD  [TP-SMD]
TP17  TESTPAD-SMD  [TP-SMD]
TP18  TESTPAD-SMD  [TP-SMD]
U3  LM4132 3V3  LM4132-3V3  [DBV(R-PDSO-G5)]
U5  M25P16-SO8  [SOIC127P600X120-8N]
X24  debug 10p  DEBUG-CORTEXM10  [DEBUG-CORTEXM10]

### Nets
!RST: X24.10 ; also sheet 2
+3.3V: C1.1 C2.1 C3.1 C4.1 C5.1 C6.1 C7.1 C8.1 C9.1 C10.1 C11.1 C12.1 C13.1 C16.1 C42.1 C58.1 L2.2(F) SV2.1 U1.7(-POWER:VDD) U1.16(-POWER:VDD) U1.26(-POWER:VDD) U1.28(-POWER:VDD) U1.39(-POWER:VDD) U1.47(-POWER:VDD) U1.51(-POWER:VDD) U1.52(-POWER:VDD) U1.68(-POWER:VBAT) U1.69(-POWER:VDD) U1.79(-POWER:VDD) U1.90(-POWER:VDD) U1.101(-POWER:VDD) U1.113(-POWER:VDD) U1.122(-POWER:VDD) U5.7(A:!HOLD) U5.8(B:VCC) X24.1 ; also sheet 2,3,5,8,9
+5V: C54.1 C55.1 D2.1(A) U3.3(EN) U3.4(VIN) ; also sheet 6,7,9
GND: C1.2 C2.2 C3.2 C4.2 C5.2 C6.2 C7.2 C8.2 C9.2 C10.2 C11.2 C12.2 C13.2 C16.2 C42.2 C45.2 C46.2 C47.2 C48.2 C52.2 C53.2 C54.2 C55.2 C58.2 C60.2 L1.2(F) R17.1 T1.2(E) T2.2(E) T3.2(E) U1.17(-POWER:GND) U1.48(-POWER:GND) U1.55(-POWER:GND) U1.58(-POWER:GND) U1.80(-POWER:GND) U1.114(-POWER:GND) U3.2(GND) U5.4(B:VSS) X24.3 X24.5 ; also sheet 2,3,5,6,7,8,9
GNDA: L1.1(E) U1.10(-POWER:GNDA)
MCU_TCK: X24.4 ; also sheet 2
MCU_TDI: X24.8 ; also sheet 2
MCU_TDO: X24.6 ; also sheet 2
MCU_TMS: X24.2 ; also sheet 2
N$12: D2.2(BC) R19.2
N$13: D2.3(RC) R20.2
N$75: D2.4(GC) R21.2
N$76: R19.1 T1.3(C)
N$77: R20.1 T2.3(C)
N$78: R21.1 T3.3(C)
PF1_LEDR: T1.1(B) TP16.1 ; also sheet 2
PF2_LEDB: T3.1(B) TP18.1 ; also sheet 2
PF3_LEDG: T2.1(B) TP17.1 ; also sheet 2
PJ1_FLASHWP: R17.2 SV2.3 ; also sheet 2
PJ1X: SV2.2 U5.3(A:!WP)
SSI0CLK: TP12.1 U5.6(A:CLK) ; also sheet 2,3
SSI0D0: TP13.1 U5.5(A:MOSI) ; also sheet 2,3
SSI0D1: TP14.1 U5.2(A:MISO) ; also sheet 2,3
SSI0FSS: TP15.1 U5.1(A:!CS) ; also sheet 2,3
VDDA: C60.1 L2.1(E) U1.8(-POWER:VDDA)
VDDC: C45.1 C46.1 C47.1 C48.1 U1.87(-POWER:VDDC) U1.115(-POWER:VDDC)
VREFA+: C52.1 C53.1 U1.9(-POWER:VREFA+) U3.5(VREF)
Unconnected: X24.9

## Sheet 5 of 9: FPGA: Programming and power
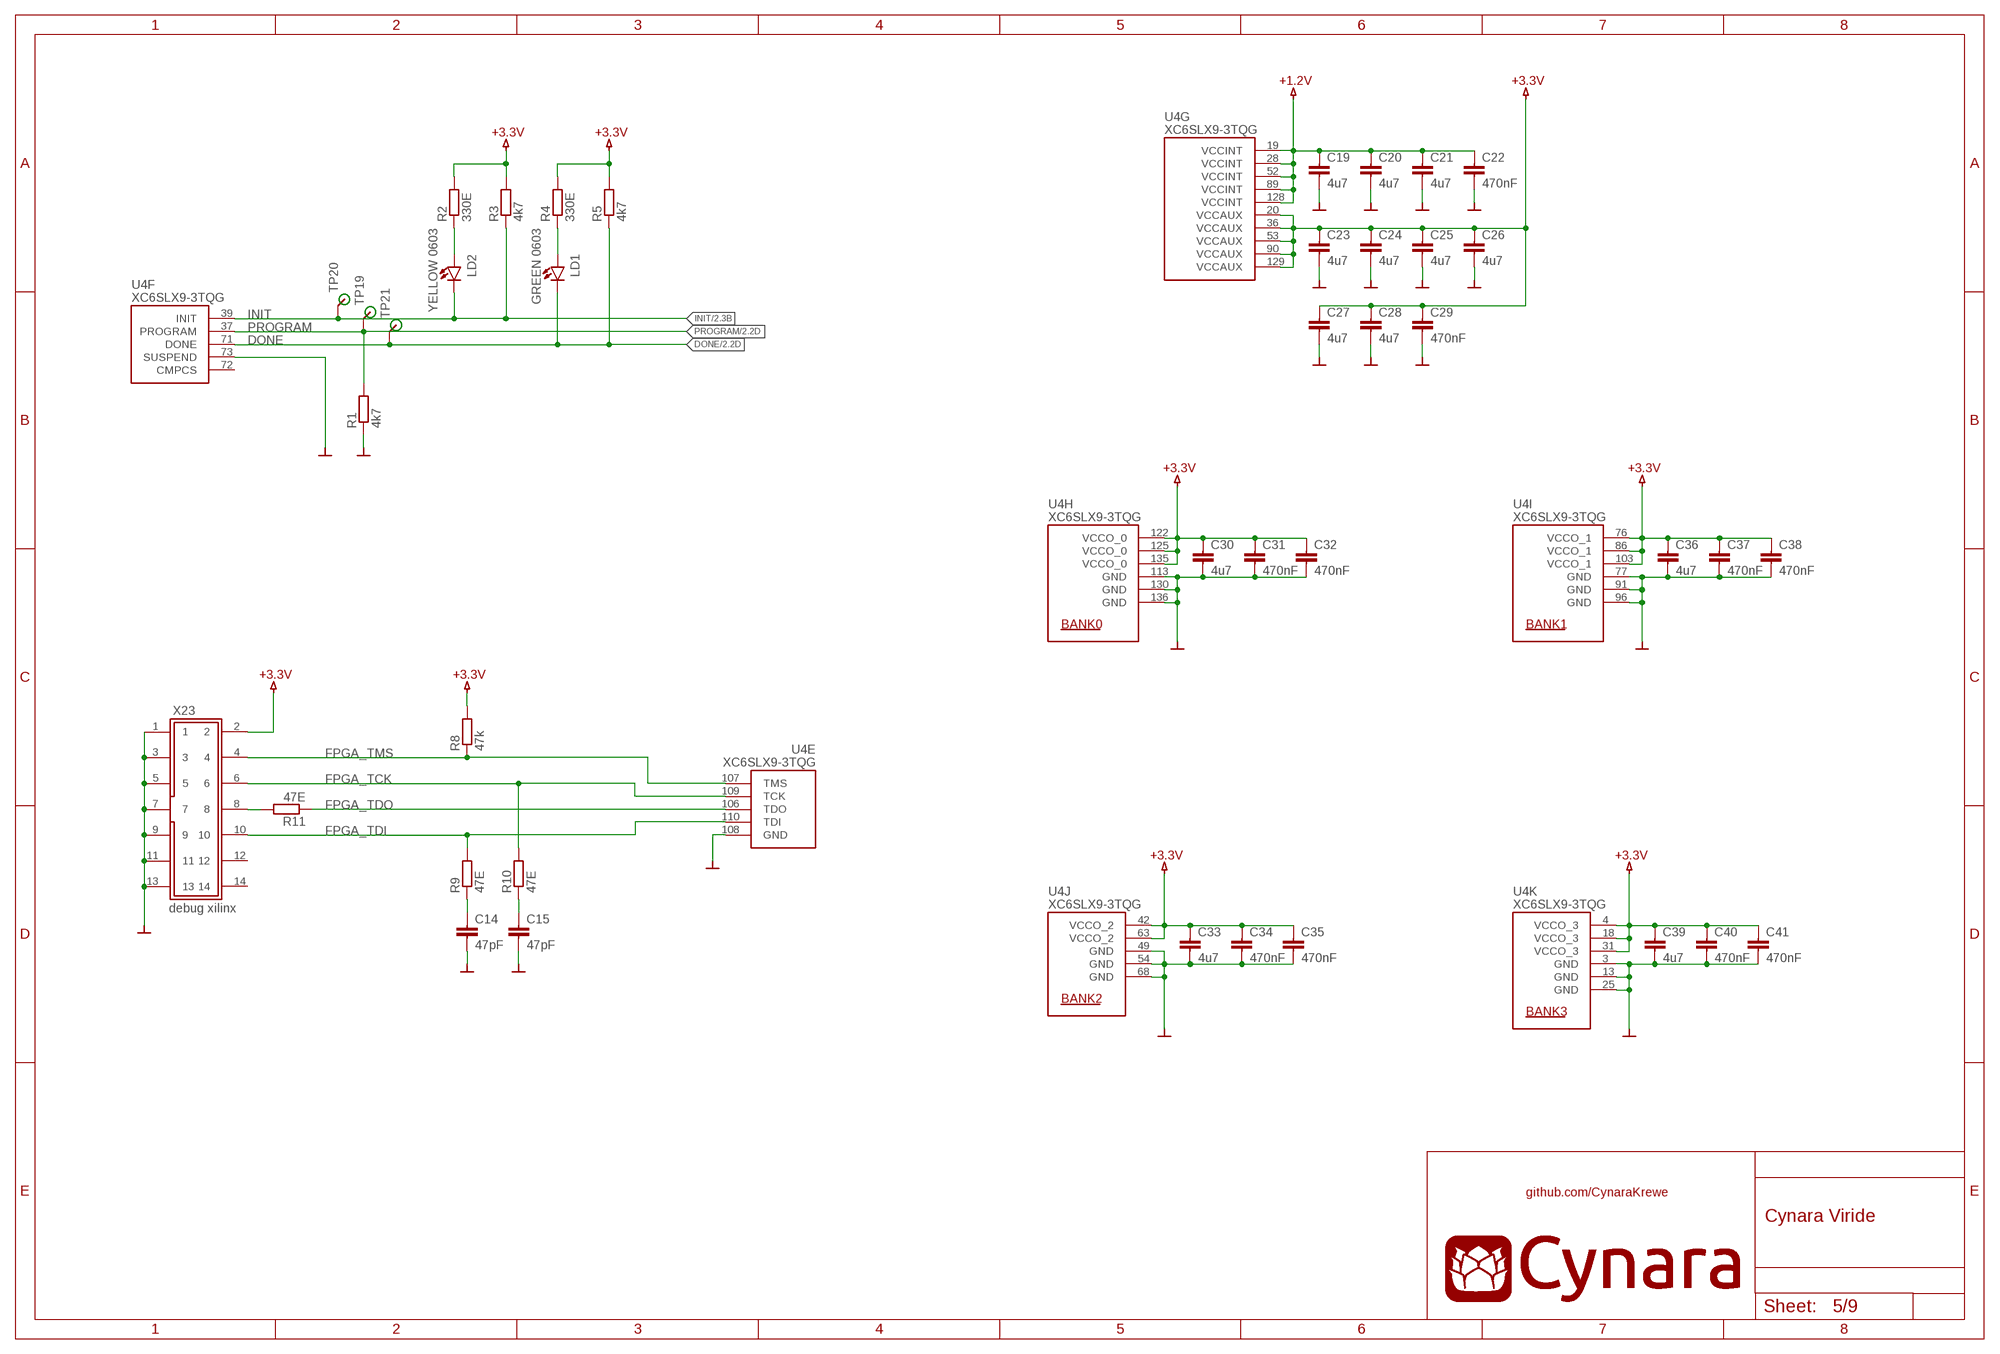
[diagram p4: schematic, sheet 5]

### Parts
C14  47pF  C-EUC0603  [C0603]
C15  47pF  C-EUC0603  [C0603]
C19  4u7  C-EUC0603  [C0603]
C20  4u7  C-EUC0603  [C0603]
C21  4u7  C-EUC0603  [C0603]
C22  470nF  C-EUC0603  [C0603]
C23  4u7  C-EUC0603  [C0603]
C24  4u7  C-EUC0603  [C0603]
C25  4u7  C-EUC0603  [C0603]
C26  4u7  C-EUC0603  [C0603]
C27  4u7  C-EUC0603  [C0603]
C28  4u7  C-EUC0603  [C0603]
C29  470nF  C-EUC0603  [C0603]
C30  4u7  C-EUC0603  [C0603]
C31  470nF  C-EUC0603  [C0603]
C32  470nF  C-EUC0603  [C0603]
C33  4u7  C-EUC0603  [C0603]
C34  470nF  C-EUC0603  [C0603]
C35  470nF  C-EUC0603  [C0603]
C36  4u7  C-EUC0603  [C0603]
C37  470nF  C-EUC0603  [C0603]
C38  470nF  C-EUC0603  [C0603]
C39  4u7  C-EUC0603  [C0603]
C40  470nF  C-EUC0603  [C0603]
C41  470nF  C-EUC0603  [C0603]
LD1  GREEN 0603  LED_GREEN-0603  [LED_1608]
LD2  YELLOW 0603  LED_YELLOW-0603  [LED_1608]
R1  4k7  R-EU_R0603  [R0603]
R2  330E  R-EU_R0603  [R0603]
R3  4k7  R-EU_R0603  [R0603]
R4  330E  R-EU_R0603  [R0603]
R5  4k7  R-EU_R0603  [R0603]
R8  47k  R-EU_R0603  [R0603]
R9  47E  R-EU_R0603  [R0603]
R10  47E  R-EU_R0603  [R0603]
R11  47E  R-EU_R0603  [R0603]
TP19  TESTPAD-SMD  [TP-SMD]
TP20  TESTPAD-SMD  [TP-SMD]
TP21  TESTPAD-SMD  [TP-SMD]
X23  debug xilinx  DEBUG-XILINX  [87832-1420]

### Nets
+1.2V: C19.1 C20.1 C21.1 C22.1 U4.19(G:VCCINT) U4.28(G:VCCINT) U4.52(G:VCCINT) U4.89(G:VCCINT) U4.128(G:VCCINT) ; also sheet 9
+3.3V: C23.1 C24.1 C25.1 C26.1 C27.1 C28.1 C29.1 C30.1 C31.1 C32.1 C33.1 C34.1 C35.1 C36.1 C37.1 C38.1 C39.1 C40.1 C41.1 R2.2 R3.2 R4.2 R5.2 R8.2 U4.4(K:VCCO_3) U4.18(K:VCCO_3) U4.20(G:VCCAUX) U4.31(K:VCCO_3) U4.36(G:VCCAUX) U4.42(J:VCCO_2) U4.53(G:VCCAUX) U4.63(J:VCCO_2) U4.76(I:VCCO_1) U4.86(I:VCCO_1) U4.90(G:VCCAUX) U4.103(I:VCCO_1) U4.122(H:VCCO_0) U4.125(H:VCCO_0) U4.129(G:VCCAUX) U4.135(H:VCCO_0) X23.2 ; also sheet 2,3,4,8,9
DONE: LD1.C(K) R5.1 TP21.1 U4.71(F:DONE) ; also sheet 2
FPGA_TCK: R10.2 U4.109(E:TCK) X23.6
FPGA_TDI: R9.2 U4.110(E:TDI) X23.10
FPGA_TDO: R11.1 U4.106(E:TDO)
FPGA_TMS: R8.1 U4.107(E:TMS) X23.4
GND: C14.2 C15.2 C19.2 C20.2 C21.2 C22.2 C23.2 C24.2 C25.2 C26.2 C27.2 C28.2 C29.2 C30.2 C31.2 C32.2 C33.2 C34.2 C35.2 C36.2 C37.2 C38.2 C39.2 C40.2 C41.2 R1.1 U4.3(K:GND) U4.13(K:GND) U4.25(K:GND) U4.49(J:GND) U4.54(J:GND) U4.68(J:GND) U4.73(F:SUSPEND) U4.77(I:GND) U4.91(I:GND) U4.96(I:GND) U4.108(E:GND) U4.113(H:GND) U4.130(H:GND) U4.136(H:GND) X23.1 X23.3 X23.5 X23.7 X23.9 X23.11 X23.13 ; also sheet 2,3,4,6,7,8,9
INIT: LD2.C(K) R3.1 TP20.1 U4.39(F:INIT) ; also sheet 2
N$1: LD2.A R2.1
N$2: LD1.A R4.1
N$3: C14.1 R9.1
N$4: C15.1 R10.1
N$5: R11.2 X23.8
PROGRAM: R1.2 TP19.1 U4.37(F:PROGRAM) ; also sheet 2
Unconnected: U4.72(F:CMPCS) X23.12 X23.14

## Sheet 6 of 9: Petal I II
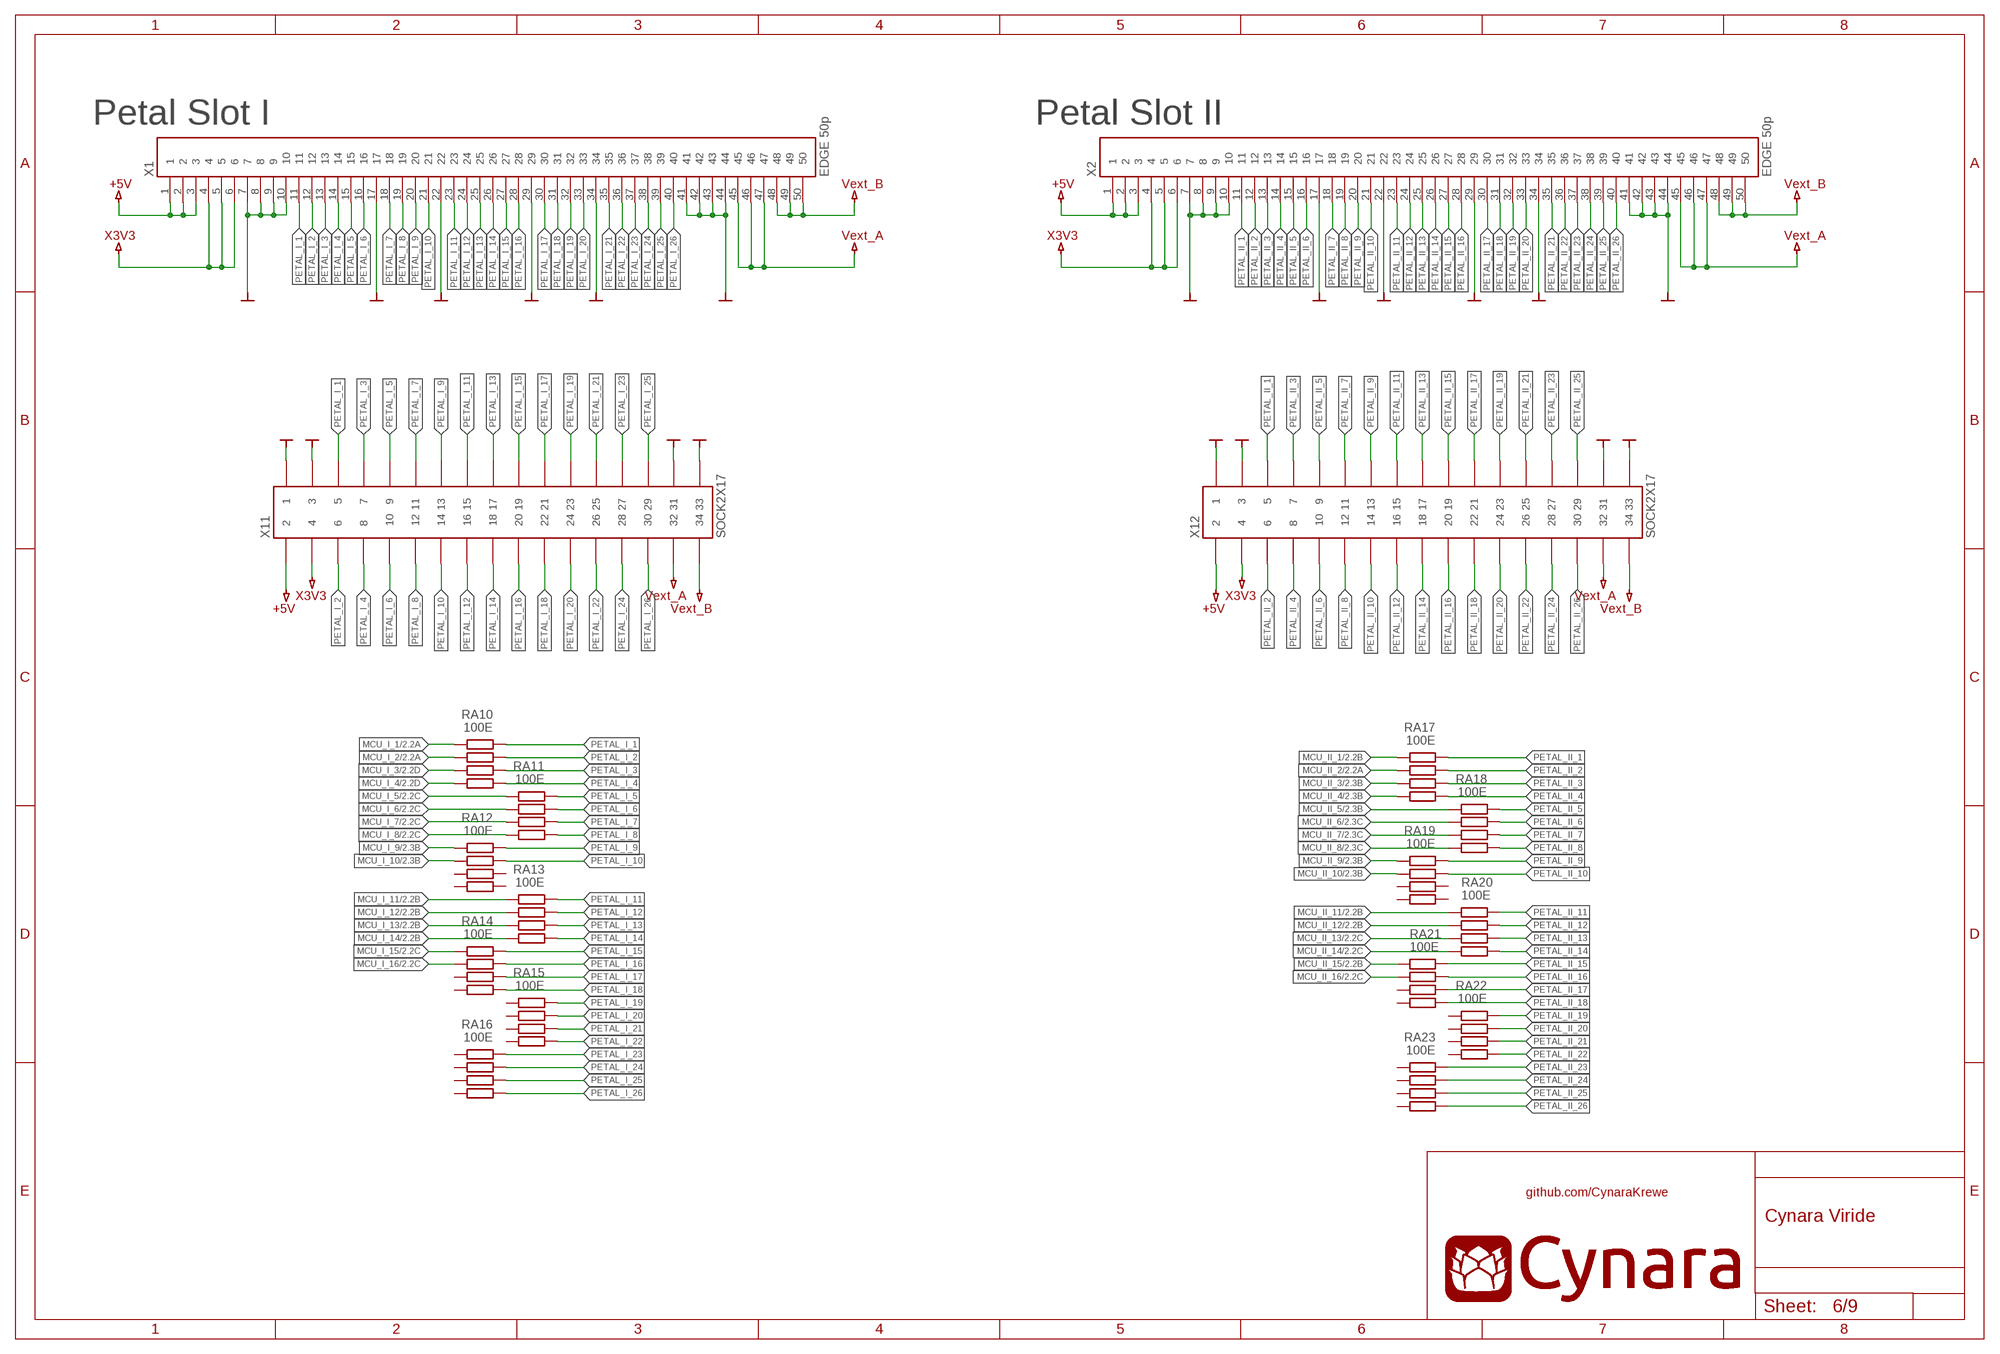
[diagram p5: schematic, sheet 6]

### Parts
RA10  100E  RES-ARRAY-100E-4X  [CRA06S]
RA11  100E  RES-ARRAY-100E-4X  [CRA06S]
RA12  100E  RES-ARRAY-100E-4X  [CRA06S]
RA13  100E  RES-ARRAY-100E-4X  [CRA06S]
RA14  100E  RES-ARRAY-100E-4X  [CRA06S]
RA15  100E  RES-ARRAY-100E-4X  [CRA06S]
RA16  100E  RES-ARRAY-100E-4X  [CRA06S]
RA17  100E  RES-ARRAY-100E-4X  [CRA06S]
RA18  100E  RES-ARRAY-100E-4X  [CRA06S]
RA19  100E  RES-ARRAY-100E-4X  [CRA06S]
RA20  100E  RES-ARRAY-100E-4X  [CRA06S]
RA21  100E  RES-ARRAY-100E-4X  [CRA06S]
RA22  100E  RES-ARRAY-100E-4X  [CRA06S]
RA23  100E  RES-ARRAY-100E-4X  [CRA06S]
X1  EDGE 50p  EDGE_CONNECT  [MB1-150-01-XX-S-XX-SL]
X2  EDGE 50p  EDGE_CONNECT  [MB1-150-01-XX-S-XX-SL]
X11  SOCK2X17  HDR2X17-F-VERT  [2X17P-FEMALE]
X12  SOCK2X17  HDR2X17-F-VERT  [2X17P-FEMALE]

### Nets
+5V: X1.1 X1.2 X1.3 X2.1 X2.2 X2.3 X11.2 X12.2 ; also sheet 4,7,9
GND: X1.7 X1.8 X1.9 X1.10 X1.17 X1.22 X1.29 X1.34 X1.41 X1.42 X1.43 X1.44 X2.7 X2.8 X2.9 X2.10 X2.17 X2.22 X2.29 X2.34 X2.41 X2.42 X2.43 X2.44 X11.1 X11.3 X11.31 X11.33 X12.1 X12.3 X12.31 X12.33 ; also sheet 2,3,4,5,7,8,9
MCU_I_1: RA10.1B ; also sheet 2
MCU_I_2: RA10.2B ; also sheet 2
MCU_I_3: RA10.3B ; also sheet 2
MCU_I_4: RA10.4B ; also sheet 2
MCU_I_5: RA11.1B ; also sheet 2
MCU_I_6: RA11.2B ; also sheet 2
MCU_I_7: RA11.3B ; also sheet 2
MCU_I_8: RA11.4B ; also sheet 2
MCU_I_9: RA12.1B ; also sheet 2
MCU_I_10: RA12.2B ; also sheet 2
MCU_I_11: RA13.1B ; also sheet 2
MCU_I_12: RA13.2B ; also sheet 2
MCU_I_13: RA13.3B ; also sheet 2
MCU_I_14: RA13.4B ; also sheet 2
MCU_I_15: RA14.1B ; also sheet 2
MCU_I_16: RA14.2B ; also sheet 2
MCU_II_1: RA17.1B ; also sheet 2
MCU_II_2: RA17.2B ; also sheet 2
MCU_II_3: RA17.3B ; also sheet 2
MCU_II_4: RA17.4B ; also sheet 2
MCU_II_5: RA18.1B ; also sheet 2
MCU_II_6: RA18.2B ; also sheet 2
MCU_II_7: RA18.3B ; also sheet 2
MCU_II_8: RA18.4B ; also sheet 2
MCU_II_9: RA19.1B ; also sheet 2
MCU_II_10: RA19.2B ; also sheet 2
MCU_II_11: RA20.1A ; also sheet 2
MCU_II_12: RA20.2A ; also sheet 2
MCU_II_13: RA20.3A ; also sheet 2
MCU_II_14: RA20.4A ; also sheet 2
MCU_II_15: RA21.1A ; also sheet 2
MCU_II_16: RA21.2A ; also sheet 2
PETAL_I_1: RA10.1A X1.11 X11.5
PETAL_I_2: RA10.2A X1.12 X11.6
PETAL_I_3: RA10.3A X1.13 X11.7
PETAL_I_4: RA10.4A X1.14 X11.8
PETAL_I_5: RA11.1A X1.15 X11.9
PETAL_I_6: RA11.2A X1.16 X11.10
PETAL_I_7: RA11.3A X1.18 X11.11
PETAL_I_8: RA11.4A X1.19 X11.12
PETAL_I_9: RA12.1A X1.20 X11.13
PETAL_I_10: RA12.2A X1.21 X11.14
PETAL_I_11: RA13.1A X1.23 X11.15
PETAL_I_12: RA13.2A X1.24 X11.16
PETAL_I_13: RA13.3A X1.25 X11.17
PETAL_I_14: RA13.4A X1.26 X11.18
PETAL_I_15: RA14.1A X1.27 X11.19
PETAL_I_16: RA14.2A X1.28 X11.20
PETAL_I_17: RA14.3A X1.30 X11.21
PETAL_I_18: RA14.4A X1.31 X11.22
PETAL_I_19: RA15.1A X1.32 X11.23
PETAL_I_20: RA15.2A X1.33 X11.24
PETAL_I_21: RA15.3A X1.35 X11.25
PETAL_I_22: RA15.4A X1.36 X11.26
PETAL_I_23: RA16.1A X1.37 X11.27
PETAL_I_24: RA16.2A X1.38 X11.28
PETAL_I_25: RA16.3A X1.39 X11.29
PETAL_I_26: RA16.4A X1.40 X11.30
PETAL_II_1: RA17.1A X2.11 X12.5
PETAL_II_2: RA17.2A X2.12 X12.6
PETAL_II_3: RA17.3A X2.13 X12.7
PETAL_II_4: RA17.4A X2.14 X12.8
PETAL_II_5: RA18.1A X2.15 X12.9
PETAL_II_6: RA18.2A X2.16 X12.10
PETAL_II_7: RA18.3A X2.18 X12.11
PETAL_II_8: RA18.4A X2.19 X12.12
PETAL_II_9: RA19.1A X2.20 X12.13
PETAL_II_10: RA19.2A X2.21 X12.14
PETAL_II_11: RA20.1B X2.23 X12.15
PETAL_II_12: RA20.2B X2.24 X12.16
PETAL_II_13: RA20.3B X2.25 X12.17
PETAL_II_14: RA20.4B X2.26 X12.18
PETAL_II_15: RA21.1B X2.27 X12.19
PETAL_II_16: RA21.2B X2.28 X12.20
PETAL_II_17: RA21.3B X2.30 X12.21
PETAL_II_18: RA21.4B X2.31 X12.22
PETAL_II_19: RA22.1A X2.32 X12.23
PETAL_II_20: RA22.2A X2.33 X12.24
PETAL_II_21: RA22.3A X2.35 X12.25
PETAL_II_22: RA22.4A X2.36 X12.26
PETAL_II_23: RA23.1A X2.37 X12.27
PETAL_II_24: RA23.2A X2.38 X12.28
PETAL_II_25: RA23.3A X2.39 X12.29
PETAL_II_26: RA23.4A X2.40 X12.30
VEXT_A: X1.45 X1.46 X1.47 X2.45 X2.46 X2.47 X11.32 X12.32 ; also sheet 7,9
VEXT_B: X1.48 X1.49 X1.50 X2.48 X2.49 X2.50 X11.34 X12.34 ; also sheet 7,9
X3V3: X1.4 X1.5 X1.6 X2.4 X2.5 X2.6 X11.4 X12.4 ; also sheet 7,9
Unconnected: RA12.3A RA12.3B RA12.4A RA12.4B RA14.3B RA14.4B RA15.1B RA15.2B RA15.3B RA15.4B RA16.1B RA16.2B RA16.3B RA16.4B RA19.3A RA19.3B RA19.4A RA19.4B RA21.3A RA21.4A RA22.1B RA22.2B RA22.3B RA22.4B RA23.1B RA23.2B RA23.3B RA23.4B

### Notes on the sheet
- Petal Slot I | Petal Slot II

## Sheet 7 of 9: Petal III IV
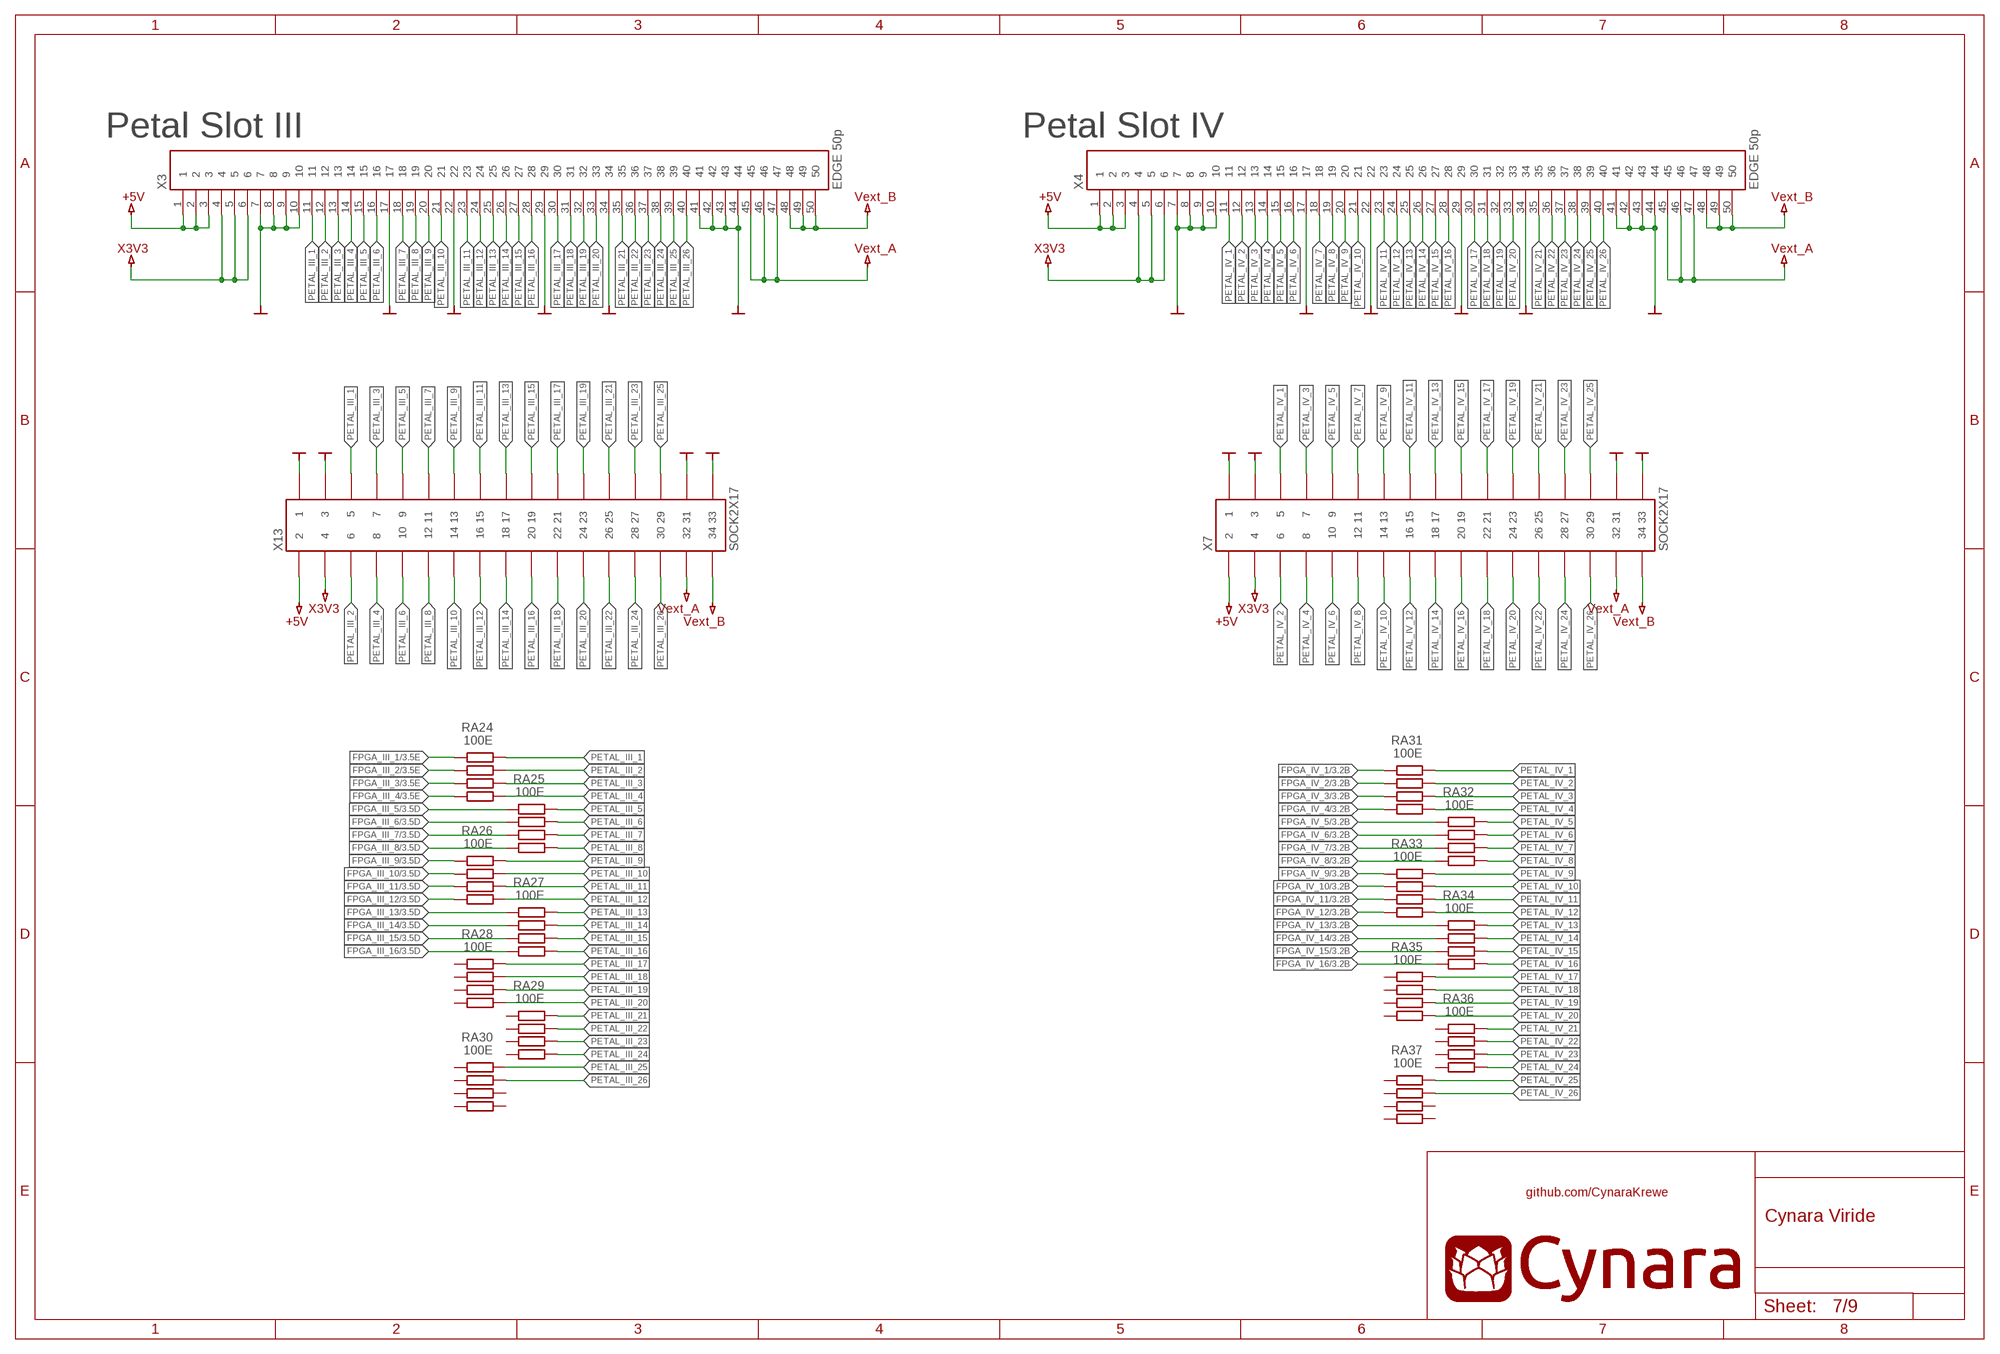
[diagram p6: schematic, sheet 7]

### Parts
RA24  100E  RES-ARRAY-100E-4X  [CRA06S]
RA25  100E  RES-ARRAY-100E-4X  [CRA06S]
RA26  100E  RES-ARRAY-100E-4X  [CRA06S]
RA27  100E  RES-ARRAY-100E-4X  [CRA06S]
RA28  100E  RES-ARRAY-100E-4X  [CRA06S]
RA29  100E  RES-ARRAY-100E-4X  [CRA06S]
RA30  100E  RES-ARRAY-100E-4X  [CRA06S]
RA31  100E  RES-ARRAY-100E-4X  [CRA06S]
RA32  100E  RES-ARRAY-100E-4X  [CRA06S]
RA33  100E  RES-ARRAY-100E-4X  [CRA06S]
RA34  100E  RES-ARRAY-100E-4X  [CRA06S]
RA35  100E  RES-ARRAY-100E-4X  [CRA06S]
RA36  100E  RES-ARRAY-100E-4X  [CRA06S]
RA37  100E  RES-ARRAY-100E-4X  [CRA06S]
X3  EDGE 50p  EDGE_CONNECT  [MB1-150-01-XX-S-XX-SL]
X4  EDGE 50p  EDGE_CONNECT  [MB1-150-01-XX-S-XX-SL]
X7  SOCK2X17  HDR2X17-F-VERT  [2X17P-FEMALE]
X13  SOCK2X17  HDR2X17-F-VERT  [2X17P-FEMALE]

### Nets
+5V: X3.1 X3.2 X3.3 X4.1 X4.2 X4.3 X7.2 X13.2 ; also sheet 4,6,9
FPGA_III_1: RA24.1B ; also sheet 3
FPGA_III_2: RA24.2B ; also sheet 3
FPGA_III_3: RA24.3B ; also sheet 3
FPGA_III_4: RA24.4B ; also sheet 3
FPGA_III_5: RA25.1B ; also sheet 3
FPGA_III_6: RA25.2B ; also sheet 3
FPGA_III_7: RA25.3B ; also sheet 3
FPGA_III_8: RA25.4B ; also sheet 3
FPGA_III_9: RA26.1B ; also sheet 3
FPGA_III_10: RA26.2B ; also sheet 3
FPGA_III_11: RA26.3B ; also sheet 3
FPGA_III_12: RA26.4B ; also sheet 3
FPGA_III_13: RA27.1B ; also sheet 3
FPGA_III_14: RA27.2B ; also sheet 3
FPGA_III_15: RA27.3B ; also sheet 3
FPGA_III_16: RA27.4B ; also sheet 3
FPGA_IV_1: RA31.1B ; also sheet 3
FPGA_IV_2: RA31.2B ; also sheet 3
FPGA_IV_3: RA31.3B ; also sheet 3
FPGA_IV_4: RA31.4B ; also sheet 3
FPGA_IV_5: RA32.1B ; also sheet 3
FPGA_IV_6: RA32.2B ; also sheet 3
FPGA_IV_7: RA32.3B ; also sheet 3
FPGA_IV_8: RA32.4B ; also sheet 3
FPGA_IV_9: RA33.1B ; also sheet 3
FPGA_IV_10: RA33.2B ; also sheet 3
FPGA_IV_11: RA33.3B ; also sheet 3
FPGA_IV_12: RA33.4B ; also sheet 3
FPGA_IV_13: RA34.1B ; also sheet 3
FPGA_IV_14: RA34.2B ; also sheet 3
FPGA_IV_15: RA34.3B ; also sheet 3
FPGA_IV_16: RA34.4B ; also sheet 3
GND: X3.7 X3.8 X3.9 X3.10 X3.17 X3.22 X3.29 X3.34 X3.41 X3.42 X3.43 X3.44 X4.7 X4.8 X4.9 X4.10 X4.17 X4.22 X4.29 X4.34 X4.41 X4.42 X4.43 X4.44 X7.1 X7.3 X7.31 X7.33 X13.1 X13.3 X13.31 X13.33 ; also sheet 2,3,4,5,6,8,9
PETAL_III_1: RA24.1A X3.11 X13.5
PETAL_III_2: RA24.2A X3.12 X13.6
PETAL_III_3: RA24.3A X3.13 X13.7
PETAL_III_4: RA24.4A X3.14 X13.8
PETAL_III_5: RA25.1A X3.15 X13.9
PETAL_III_6: RA25.2A X3.16 X13.10
PETAL_III_7: RA25.3A X3.18 X13.11
PETAL_III_8: RA25.4A X3.19 X13.12
PETAL_III_9: RA26.1A X3.20 X13.13
PETAL_III_10: RA26.2A X3.21 X13.14
PETAL_III_11: RA26.3A X3.23 X13.15
PETAL_III_12: RA26.4A X3.24 X13.16
PETAL_III_13: RA27.1A X3.25 X13.17
PETAL_III_14: RA27.2A X3.26 X13.18
PETAL_III_15: RA27.3A X3.27 X13.19
PETAL_III_16: RA27.4A X3.28 X13.20
PETAL_III_17: RA28.1A X3.30 X13.21
PETAL_III_18: RA28.2A X3.31 X13.22
PETAL_III_19: RA28.3A X3.32 X13.23
PETAL_III_20: RA28.4A X3.33 X13.24
PETAL_III_21: RA29.1A X3.35 X13.25
PETAL_III_22: RA29.2A X3.36 X13.26
PETAL_III_23: RA29.3A X3.37 X13.27
PETAL_III_24: RA29.4A X3.38 X13.28
PETAL_III_25: RA30.1A X3.39 X13.29
PETAL_III_26: RA30.2A X3.40 X13.30
PETAL_IV_1: RA31.1A X4.11 X7.5
PETAL_IV_2: RA31.2A X4.12 X7.6
PETAL_IV_3: RA31.3A X4.13 X7.7
PETAL_IV_4: RA31.4A X4.14 X7.8
PETAL_IV_5: RA32.1A X4.15 X7.9
PETAL_IV_6: RA32.2A X4.16 X7.10
PETAL_IV_7: RA32.3A X4.18 X7.11
PETAL_IV_8: RA32.4A X4.19 X7.12
PETAL_IV_9: RA33.1A X4.20 X7.13
PETAL_IV_10: RA33.2A X4.21 X7.14
PETAL_IV_11: RA33.3A X4.23 X7.15
PETAL_IV_12: RA33.4A X4.24 X7.16
PETAL_IV_13: RA34.1A X4.25 X7.17
PETAL_IV_14: RA34.2A X4.26 X7.18
PETAL_IV_15: RA34.3A X4.27 X7.19
PETAL_IV_16: RA34.4A X4.28 X7.20
PETAL_IV_17: RA35.1A X4.30 X7.21
PETAL_IV_18: RA35.2A X4.31 X7.22
PETAL_IV_19: RA35.3A X4.32 X7.23
PETAL_IV_20: RA35.4A X4.33 X7.24
PETAL_IV_21: RA36.1A X4.35 X7.25
PETAL_IV_22: RA36.2A X4.36 X7.26
PETAL_IV_23: RA36.3A X4.37 X7.27
PETAL_IV_24: RA36.4A X4.38 X7.28
PETAL_IV_25: RA37.1A X4.39 X7.29
PETAL_IV_26: RA37.2A X4.40 X7.30
VEXT_A: X3.45 X3.46 X3.47 X4.45 X4.46 X4.47 X7.32 X13.32 ; also sheet 6,9
VEXT_B: X3.48 X3.49 X3.50 X4.48 X4.49 X4.50 X7.34 X13.34 ; also sheet 6,9
X3V3: X3.4 X3.5 X3.6 X4.4 X4.5 X4.6 X7.4 X13.4 ; also sheet 6,9
Unconnected: RA28.1B RA28.2B RA28.3B RA28.4B RA29.1B RA29.2B RA29.3B RA29.4B RA30.1B RA30.2B RA30.3A RA30.3B RA30.4A RA30.4B RA35.1B RA35.2B RA35.3B RA35.4B RA36.1B RA36.2B RA36.3B RA36.4B RA37.1B RA37.2B RA37.3A RA37.3B RA37.4A RA37.4B

### Notes on the sheet
- Petal Slot III | Petal Slot IV

## Sheet 8 of 9: Communications
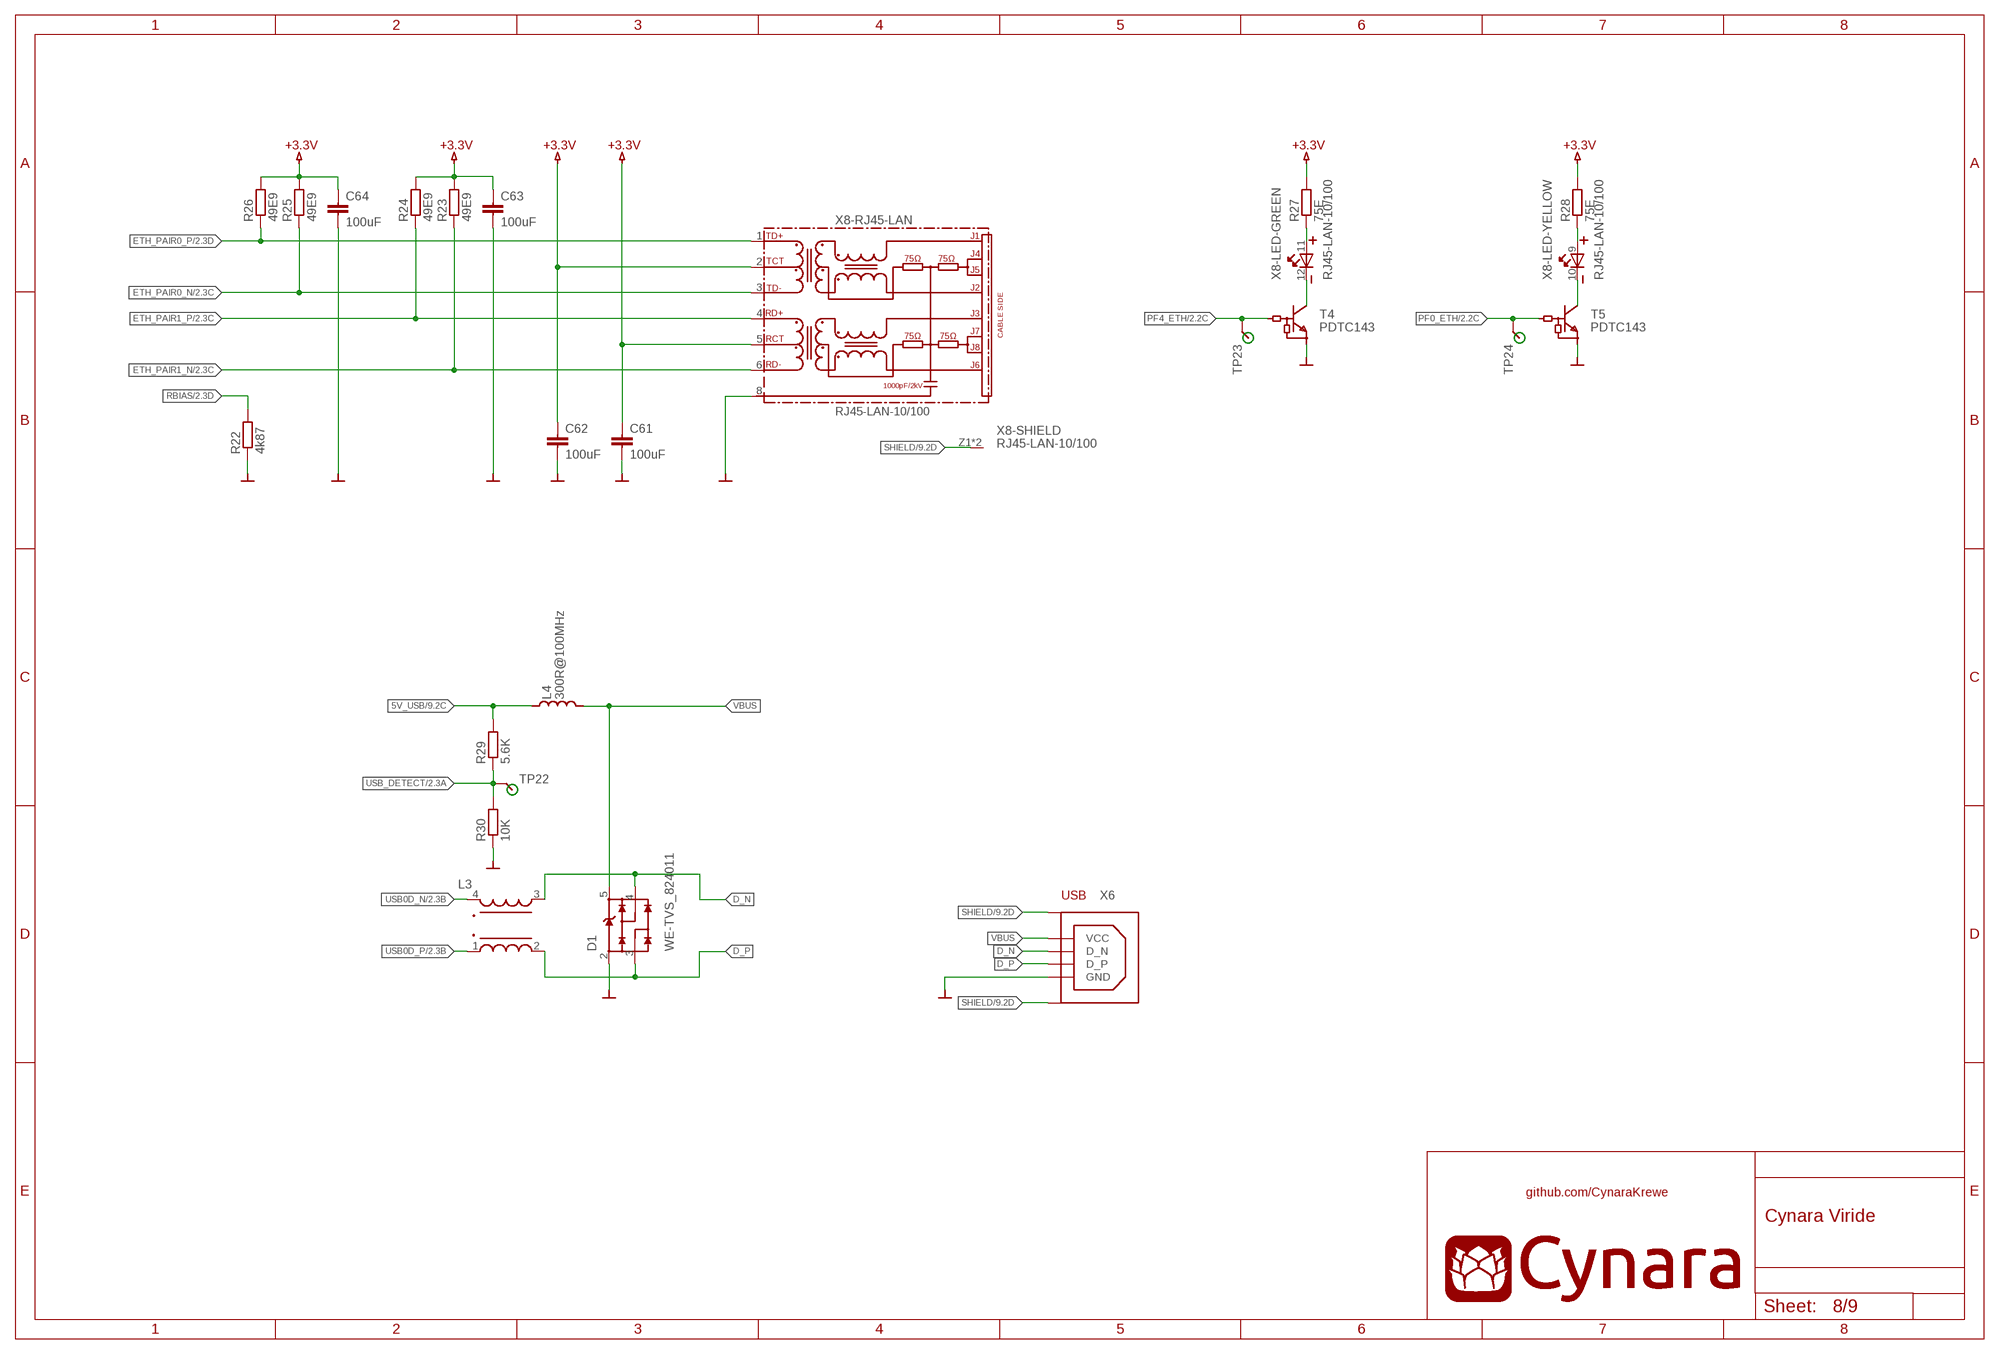
[diagram p7: schematic, sheet 8]

### Parts
C61  100uF  C-EUC0603  [C0603]
C62  100uF  C-EUC0603  [C0603]
C63  100uF  C-EUC0603  [C0603]
C64  100uF  C-EUC0603  [C0603]
D1  WE-TVS_824011  [WE-TVS_SOT23-5L]
L3  WE-CNSW_1206  [WE-CNSW_1206]
L4  300R@100MHz  BEAD_300R@100MHZ[0603]  [L1608]
R22  4k87  R-EU_R0603  [R0603]
R23  49E9  R-EU_R0603  [R0603]
R24  49E9  R-EU_R0603  [R0603]
R25  49E9  R-EU_R0603  [R0603]
R26  49E9  R-EU_R0603  [R0603]
R27  75E  R-EU_R0603  [R0603]
R28  75E  R-EU_R0603  [R0603]
R29  5.6K  R-EU_R0603  [R0603]
R30  10K  R-EU_R0603  [R0603]
T4  PDTC143  DIGITAL_TRANSISTOR4K7  [SOT23-3]
T5  PDTC143  DIGITAL_TRANSISTOR4K7  [SOT23-3]
TP22  TESTPAD-SMD  [TP-SMD]
TP23  TESTPAD-SMD  [TP-SMD]
TP24  TESTPAD-SMD  [TP-SMD]
X6  USB2.0-TYPE-B  [61400416121]
X8  RJ45-LAN-10/100  [74990-WITH-LED-TYPE1]

### Nets
5V_USB: L4.1(E) R29.2 ; also sheet 9
+3.3V: C61.1 C62.1 C63.1 C64.1 R23.2 R24.2 R25.2 R26.2 R27.2 R28.2 X8.2(-RJ45-LAN:TCT) X8.5(-RJ45-LAN:RCT) ; also sheet 2,3,4,5,9
D_N: D1.4 L3.3 X6.2(D_N)
D_P: D1.3 L3.2 X6.3(D_P)
ETH_PAIR0_N: R25.1 X8.3(-RJ45-LAN:TD-) ; also sheet 2
ETH_PAIR0_P: R26.1 X8.1(-RJ45-LAN:TD+) ; also sheet 2
ETH_PAIR1_N: R23.1 X8.6(-RJ45-LAN:RD-) ; also sheet 2
ETH_PAIR1_P: R24.1 X8.4(-RJ45-LAN:RD+) ; also sheet 2
GND: C61.2 C62.2 C63.2 C64.2 D1.2(GND) R22.1 R30.1 T4.2(E) T5.2(E) X6.4(GND) X8.8(-RJ45-LAN:SH) ; also sheet 2,3,4,5,6,7,9
N$6: R27.1 X8.11(-LED-GREEN:A)
N$14: T4.3(C) X8.12(-LED-GREEN:K)
N$18: R28.1 X8.9(-LED-YELLOW:A)
N$21: T5.3(C) X8.10(-LED-YELLOW:K)
PF0_ETH: T5.1(B) TP24.1 ; also sheet 2
PF4_ETH: T4.1(B) TP23.1 ; also sheet 2
RBIAS: R22.2 ; also sheet 2
SHIELD: X6.Z1(GND) X6.Z2(GND) X8.Z1 X8.Z2 ; also sheet 9
USB0D_N: L3.4 ; also sheet 2
USB0D_P: L3.1 ; also sheet 2
USB_DETECT: R29.1 R30.2 TP22.1 ; also sheet 2
VBUS: D1.5(VDD) L4.2(F) X6.1(VCC)
Unconnected: X8.7(NC:NC)

## Sheet 9 of 9: Power
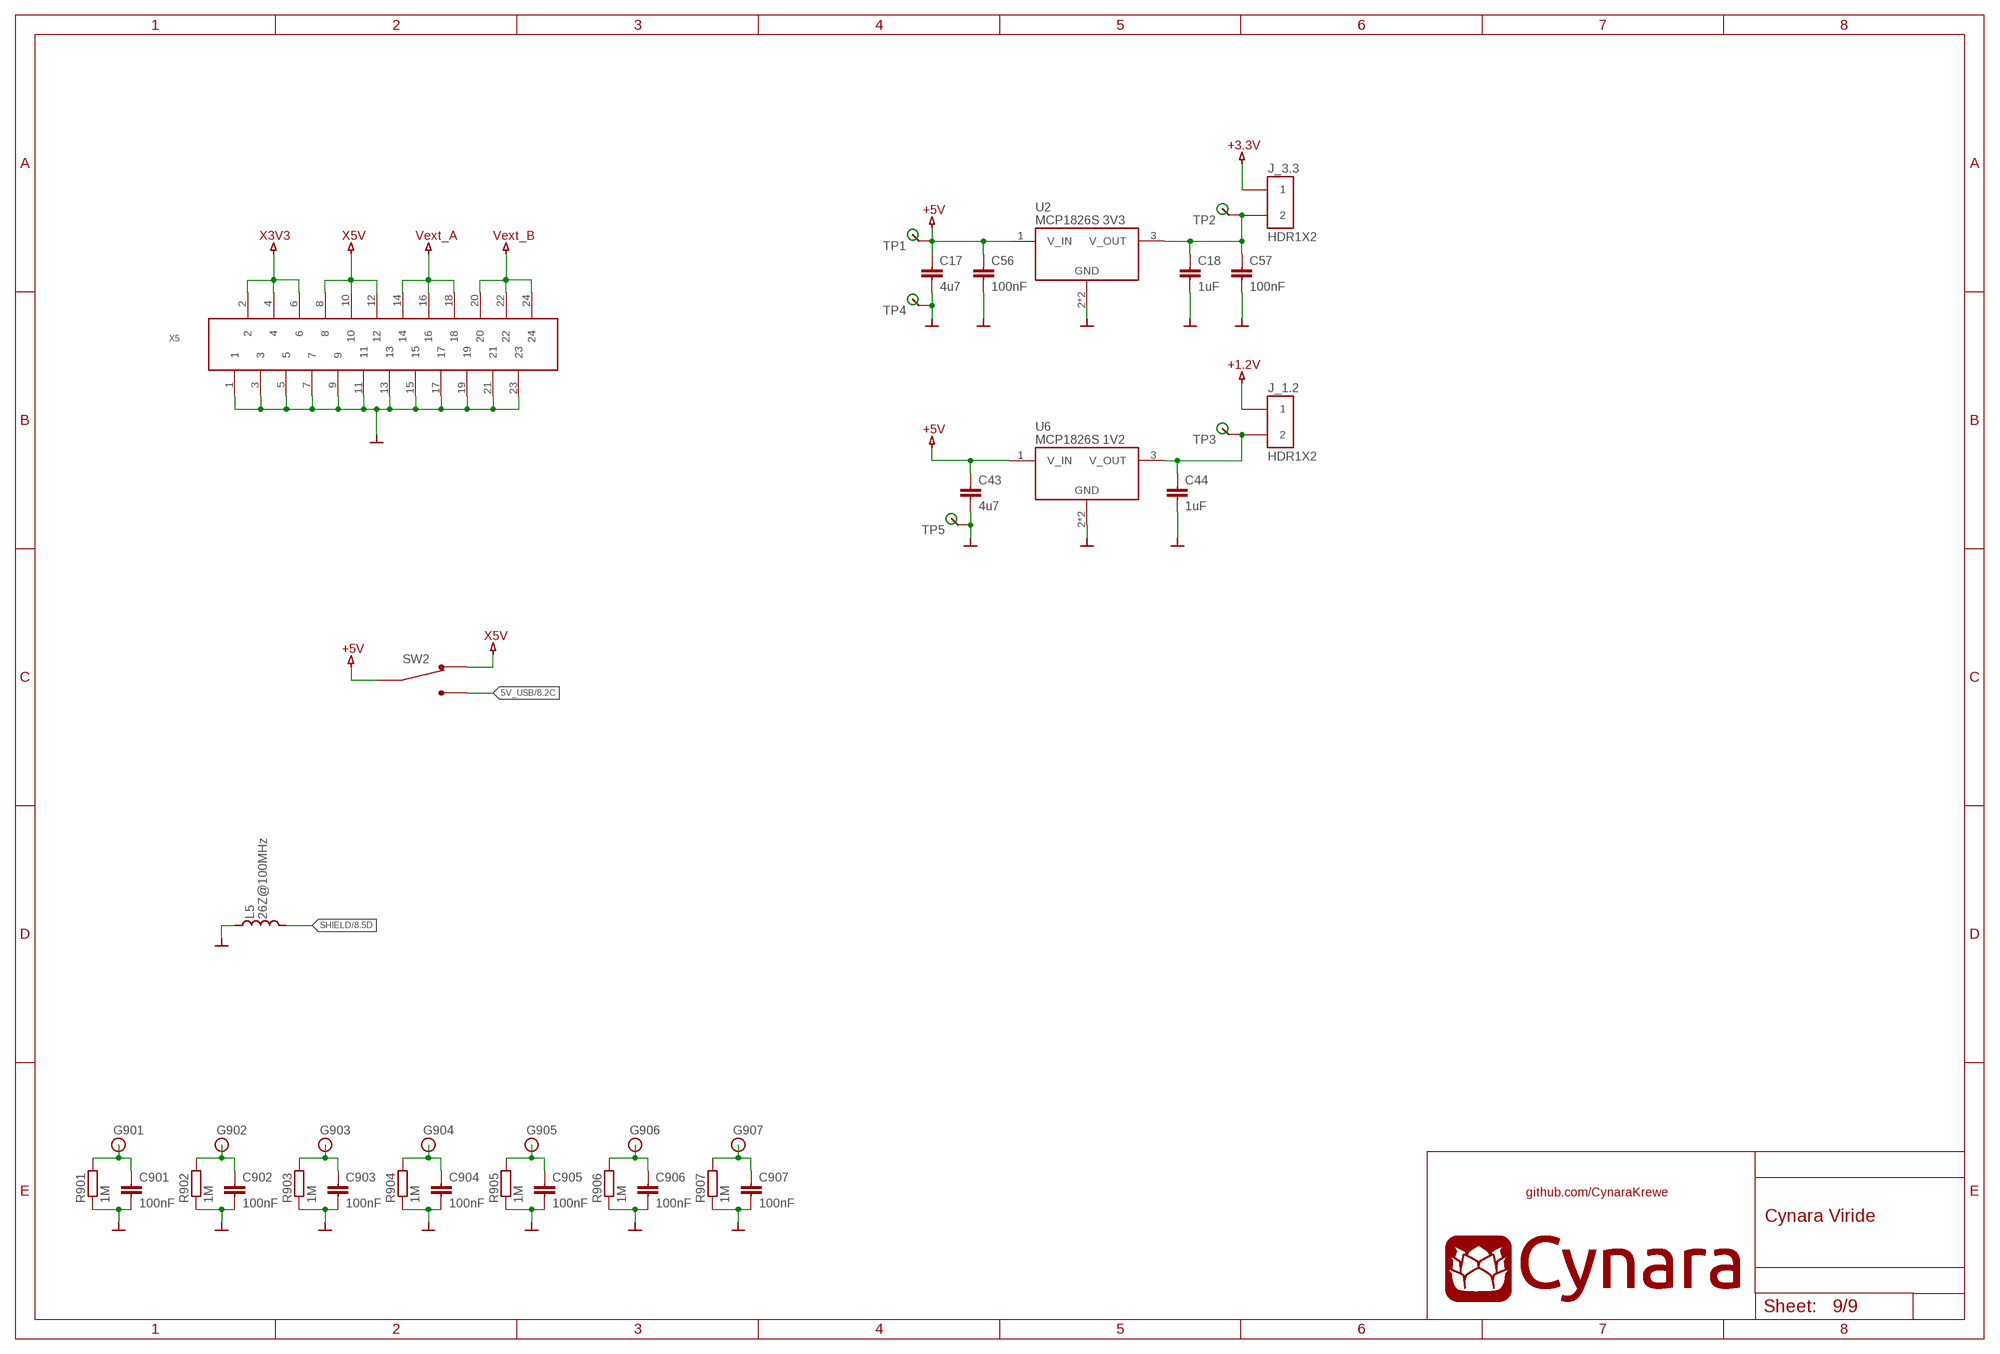
[diagram p8: schematic, sheet 9]

### Parts
C17  4u7  C-EUC0603  [C0603]
C18  1uF  C-EUC0603  [C0603]
C43  4u7  C-EUC0603  [C0603]
C44  1uF  C-EUC0603  [C0603]
C56  100nF  C-EUC0603  [C0603]
C57  100nF  C-EUC0603  [C0603]
C901  100nF  C-EUC0603  [C0603]
C902  100nF  C-EUC0603  [C0603]
C903  100nF  C-EUC0603  [C0603]
C904  100nF  C-EUC0603  [C0603]
C905  100nF  C-EUC0603  [C0603]
C906  100nF  C-EUC0603  [C0603]
C907  100nF  C-EUC0603  [C0603]
G901  HOLE=3,5/6,6  [HOLE-3,5/6,6]
G902  HOLE=3,5/6,6  [HOLE-3,5/6,6]
G903  HOLE=3,5/6,6  [HOLE-3,5/6,6]
G904  HOLE=3,5/6,6  [HOLE-3,5/6,6]
G905  HOLE=3,5/6,6  [HOLE-3,5/6,6]
G906  HOLE=3,5/6,6  [HOLE-3,5/6,6]
G907  HOLE=3,5/6,6  [HOLE-3,5/6,6]
J_1.2  HDR1X2  HDR1X2-M  [1X2]
J_3.3  HDR1X2  HDR1X2-M  [1X2]
L5  26Z@100MHz  BEAD_26Z@100MHZ[0603]  [L1608]
R901  1M  R-EU_R0603  [R0603]
R902  1M  R-EU_R0603  [R0603]
R903  1M  R-EU_R0603  [R0603]
R904  1M  R-EU_R0603  [R0603]
R905  1M  R-EU_R0603  [R0603]
R906  1M  R-EU_R0603  [R0603]
R907  1M  R-EU_R0603  [R0603]
SW2  C&K_1000  [1XXX-MX-XX-C]
TP1  TESTPAD-SMD  [TP-SMD]
TP2  TESTPAD-SMD  [TP-SMD]
TP3  TESTPAD-SMD  [TP-SMD]
TP4  TESTPAD-SMD  [TP-SMD]
TP5  TESTPAD-SMD  [TP-SMD]
U2  MCP1826S 3V3  MCP1826S-3V3  [SOT-223]
U6  MCP1826S 1V2  MCP1826S-1V2  [SOT-223]
X5  MicroMatch 24  WR-MM_MALEP24  [MICROMATCH-24-MALE]

### Nets
5V_USB: SW2.1 ; also sheet 8
+1.2V: J_1.2.1 ; also sheet 5
+3.3V: J_3.3.1 ; also sheet 2,3,4,5,8
+5V: C17.1 C43.1 C56.1 SW2.2 TP1.1 U2.1(V_IN) U6.1(V_IN) ; also sheet 4,6,7
G901: C901.1 G901.1 R901.2
G902: C902.1 G902.1 R902.2
G903: C903.1 G903.1 R903.2
G904: C904.1 G904.1 R904.2
G905: C905.1 G905.1 R905.2
G906: C906.1 G906.1 R906.2
G907: C907.1 G907.1 R907.2
GND: C17.2 C18.2 C43.2 C44.2 C56.2 C57.2 C901.2 C902.2 C903.2 C904.2 C905.2 C906.2 C907.2 L5.1(E) R901.1 R902.1 R903.1 R904.1 R905.1 R906.1 R907.1 TP4.1 TP5.1 U2.2(GND) U2.4(GND) U6.2(GND) U6.4(GND) X5.1 X5.3 X5.5 X5.7 X5.9 X5.11 X5.13 X5.15 X5.17 X5.19 X5.21 X5.23 ; also sheet 2,3,4,5,6,7,8
N$7: C18.1 C57.1 J_3.3.2 TP2.1 U2.3(V_OUT)
N$10: C44.1 J_1.2.2 TP3.1 U6.3(V_OUT)
SHIELD: L5.2(F) ; also sheet 8
VEXT_A: X5.14 X5.16 X5.18 ; also sheet 6,7
VEXT_B: X5.20 X5.22 X5.24 ; also sheet 6,7
X3V3: X5.2 X5.4 X5.6 ; also sheet 6,7
X5V: SW2.3 X5.8 X5.10 X5.12

## Library data of the parts
C1-C64 C901-C907 = Cynara-Passives:C-EU: CAPACITOR, European symbol
D1 = Cynara-Actives:WE-TVS_824011: TVS Diode High Speed Series Characteristics Low clamping voltage Sturdy design Very low capacitance Flow Thru Design for a simple layout Rail to Rail protection Epoxy flame resistant UL94 V-0 RoHS, REACH and free of halogens Applications Very fast data lines USB 2.0 Ethernet PoE VGA Sim Cards Keypads ESD protection in accordance with EN 61000-4-2, – 8 kV contact discharge – 15 kV air discharge <http://katalog.we-online.de/media/images/eisos/VarTVS_highspeed_pf2.jpg.jpg> Details see: http://katalog.we-online.de/en/pbs/WE-TVS_High_Speed/824001? Updated by Dan Xu 2014-07-11 2014 (C) Wurth Elektronik
D2 = Cynara-Actives:WL-SFTW: SMD full-color TOP LED Characteristics Low energy consumption High reliability Low current requirement Fast switching No UV/IR radiation High brightness RGB individual control Compact package outline Black surface Applications Flash light Switch indicators Equipments indicators Accent and decorative lighting Electronic signage Video displays Backlight for LCDs, PDAs and TVs Oven, microwave Street lighting Ideal for lateral coupling in light guides <http://katalog.we-online.de/media/images/eipal/WL-SFTW_pf2.jpg> Details see: http://katalog.we-online.de/en/led/WL-SFTW?m Updated 2015-04-10 2015 (C) Wurth Elektronik
G901-G907 = Cynara-Misc:HOLE; BEHUIZING: 6,6mm; WAARDE: 3,5mm; XTRA: peel-off
J_1.2 J_3.3 = Cynara-Connectors:HDR1X2-M; MANUFACTURER: Wurth; MANUFACTURERPARTNO: 61300211121
L1 L2 L5 = Cynara-Passives:BEAD_; MANUFACTURER: Murata; MANUFACTURERPARTNO: BLM18KG260TN1D; ORDERCODE: 1781087; SUPPLIER: FARNELL
L3 = Cynara-Discretes:WE-CNSW: WE-CNSW SMD Common Mode Line Filter Characteristics High common mode noise suppression at high frequencies Small influence on high speed signals through winding symmetry Operating temperature: –40 ºC to +125 ºC (Size 0805/1206/1812); –40 ºC to +105 ºC (Size 0603) Applications USB 2.0 IEEE 1394 (Firewire) LVDS High Speed Data Lines LAN <http://katalog.we-online.de/media/images/eisos/IndCNSW_pf2.jpg> Details see: http://katalog.we-online.de/en/pbs/WE-CNSW Updated by Dan Xu 2014-06-30 2014 (C) Wurth Elektronik
L4 = Cynara-Passives:BEAD_; MANUFACTURER: Wurth; MANUFACTURERPARTNO: 742792641; ORDERCODE: 742792641; SUPPLIER: WURTH
LD1 = Cynara-Actives:LED: Kingbright LEDs; MANUFACTURER: KINGBRIGHT; MANUFACTURERPARTNO: KP-1608SGC; ORDERCODE: 8529833; SUPPLIER: FARNELL
LD2 = Cynara-Actives:LED: Kingbright LEDs; MANUFACTURER: KINGBRIGHT; MANUFACTURERPARTNO: KP-1608SYC; ORDERCODE: 2290330; SUPPLIER: FARNELL
Q1 = Cynara-Actives:TXC-7B: TXC 5 x 3.2 mm SMD SEAM CRYSTAL 7B SERIES
Q2 = Cynara-Actives:TXC-7W: TXC 7 X 5 mm SMD CMOS CXO 7W SERIES
R1-R30 R901-R907 = Cynara-Passives:R-EU_: RESISTOR, European symbol
RA1-RA37 = Cynara-Passives:RES-ARRAY-
SV1 SV2 = con-lstb:MA03-1: PIN HEADER; OC_FARNELL: unknown; OC_NEWARK: unknown
SW1 = Cynara-ElectroMechanical:430181038816: WS-TSS-4.5x4.5 mm SMD Tact Switch,4 pins
SW2 = Cynara-ElectroMechanical:C&K_1000: 1000 Series Miniature Slide Switches Datasheet <http://www.farnell.com/datasheets/1839905.pdf>; MANUFACTURER: C&K Components; MANUFACTURERPARTNO: 1101M2S3CGE2; ORDERCODE: 2435380; SUPPLIER: Farnell
T1-T5 = Cynara-Actives:DIGITAL_TRANSISTOR; MANUFACTURER: NXP; MANUFACTURERPARTNO: PDTC143ET,215; ORDERCODE: 2319267; SUPPLIER: FARNELL
TP1-TP10 TP12-TP24 = Cynara-Misc:TESTPAD: testpunt; BEHUIZING: TP-EZ
U1 = Cynara-IntegratedCircuits:SPLIT-TM4C129ENCPDT: Tiva TM4C129ENCPDT <http://www.ti.com/lit/ds/spms441b/spms441b.pdf> Microcontroller; MANUFACTURER: Texas Instruments; MANUFACTURERPARTNO: TM4C129ENCPDT
U2 = Cynara-IntegratedCircuits:MCP1826S: Microchip - MCP1826S <http://ww1.microchip.com/downloads/en/DeviceDoc/22057B.pdf> The MCP1826S-3302E/AB is a 1A ceramic output cap stable low output voltage Low Dropout Regulator provides high-current and low-output voltages. The MCP1826 comes in a fixed or adjustable output voltage version, with an output voltage range of 0.8 to 5.0V. The 1000mA output current capability, combined with the low-output voltage capability, make the MCP1826 a good choice for new sub-1.8V output voltage LDO applications that have high current demands. The MCP1826S is a 3-pin fixed voltage version. The MCP1826/MCP1826S is stable using ceramic output capacitors that inherently provide lower output noise and reduce the size and cost of the entire regulator solution. Only 1µF of output capacitance is needed to stabilize the LDO. 300mV (typical) Low dropout voltage Output voltage from 0.8 to 5V Stable with 1µF ceramic output cap Power good output 120µA Typical low supply current; MANUFACTURER: Microchip; MANUFACTURERPARTNO: MCP1826S-3302E/DB; ORDERCODE: 1578424; SUPPLIER: Farnell
U3 = Cynara-IntegratedCircuits:LM4132: Texas instruments - LM4132 <http://www.ti.com/lit/gpn/lm4132> Description The LM4132 family of precision voltage references performs comparable to the best laser-trimmed bipolar references, but in cost-effective CMOS technology. The key to this breakthrough is the use of EEPROM registers for correction of curvature, temperature coefficient (tempco), and accuracy on a CMOS bandgap architecture allowing package-level programming to overcome assembly shift. The shifts in voltage accuracy and tempco during assembly of die into plastic packages limit the accuracy of references trimmed with laser techniques. Unlike other LDO references, the LM4132 can deliver up to 20 mA and does not require an output capacitor or buffer amplifier. These advantages along with the SOT-23 packaging are important for space-critical applications. Series references provide lower power consumption than shunt references, because they do not have to idle the maximum possible load current under no-load conditions. This advantage, the low quiescent current (60 µA), and the low dropout voltage (400 mV) make the LM4132 ideal for battery-powered solutions. The LM4132 is available in five grades (A, B, C, D and E) for greater flexibility. The best grade devices (A) have an initial accuracy of 0.05% with a specified temperature coefficient of 10 ppm/°C or less, while the lowest grade devices (E) have an initial accuracy of 0.5% and a tempco of 30 ppm/°C. Features Qualified for Automotive Applications AEC-Q100 Qualified With the Following Results: Device Temperature Grae 1: –40°C to 125°C Ambient Operating Temperature Range Device HBM ESD Classification Level 2 Output Initial Voltage Accuracy 0.05% Low Temperature Coefficient 10 ppm/°C Low Supply Current, 60 µA Enable Pin Allowing a 3-µA Shutdown Mode 20-mA Output Current Voltage Options 1.8 V, 2.048 V, 2.5 V, 3 V, 3.3 V, 4.096 V Custom Voltage Options Available (1.8 V to 4.096 V) VIN Range of VREF + 400 mV to 5.5 V at 10 mA Stable With Low ESR Ceramic Capacitors; MANUFACTURER: Texas Instruments; MANUFACTURERPARTNO: LM4132AMF-3.3/NOPB
U4 = Cynara-IntegratedCircuits:XC6SLX9-3TQG144C: Xilinx Spartan-6 in 144 pin Thin Quad Flat-Pack Package; MANUFACTURER: Xilinx; MANUFACTURERPARTNO: XC6SLX9-3TQG144C
U5 = Cynara-IntegratedCircuits:M25P16: M25P16 SPI FLASH; MANUFACTURER: Micron; MANUFACTURERPARTNO: M25P16-VMN6P; ORDERCODE: 1734973; SUPPLIER: FARNELL
U6 = Cynara-IntegratedCircuits:MCP1826S: Microchip - MCP1826S <http://ww1.microchip.com/downloads/en/DeviceDoc/22057B.pdf> The MCP1826S-3302E/AB is a 1A ceramic output cap stable low output voltage Low Dropout Regulator provides high-current and low-output voltages. The MCP1826 comes in a fixed or adjustable output voltage version, with an output voltage range of 0.8 to 5.0V. The 1000mA output current capability, combined with the low-output voltage capability, make the MCP1826 a good choice for new sub-1.8V output voltage LDO applications that have high current demands. The MCP1826S is a 3-pin fixed voltage version. The MCP1826/MCP1826S is stable using ceramic output capacitors that inherently provide lower output noise and reduce the size and cost of the entire regulator solution. Only 1µF of output capacitance is needed to stabilize the LDO. 300mV (typical) Low dropout voltage Output voltage from 0.8 to 5V Stable with 1µF ceramic output cap Power good output 120µA Typical low supply current; MANUFACTURER: Microchip; MANUFACTURERPARTNO: MCP1826S-1202E/DB; ORDERCODE: 1851995; SUPPLIER: Farnell
U$21 = Cynara-Misc:CYNARA_FRONT: Huge Cynara logo meant for the front page of the schematic.
X1-X4 = Cynara-Connectors:EDGE_CONNECT: 1MM MINI-CARD GUIDE.; MANUFACTURER: SAMTEC; MANUFACTURERPARTNO: MB1-150-01-F-S-02-SL
X5 = Cynara-Connectors:WR-MM_MALEP24: WR-MM Male Connector with Polarization, 24 Pins=>Code : Con_BTB_MM_Male_THT_690357102472 <http://katalog.we-online.de/media/thumbs2/eican/thb_Con_BTB_MM_Male_THT_69035710xx72_pf2.jpg> Details see: http://katalog.we-online.de/en/em/6903_5710_xx_72 Created 2014-06-04, Karrer Zheng 2014 (C) Würth Elektronik; MANUFACTURER: WURTH; MANUFACTURERPARTNO: 690357102472
X6 = Cynara-Connectors:USB2.0: WR-COM Horizontal USB Type B=>Code : Con_I-O_COM_USB-2.0_B_61400416121 <http://katalog.we-online.de/media/images/eican/Con_I-O_COM_USB-2.0_B_61400416121_pf2.jpg> Details see: http://katalog.we-online.de/en/em/614_004_161_21 Created 2014-07-09, Karrer Zheng 2014 (C) Würth Elektronik; MANUFACTURER: Wurth; MANUFACTURERPARTNO: 61400416121; ORDERCODE: 61400416121; SUPPLIER: Wurth
X7 X11-X13 = Cynara-Connectors:HDR2X17-F; MANUFACTURER: WURTH; MANUFACTURERPARTNO: 61303421821
X8 = Cynara-Connectors:RJ45-LAN-10/100: Order Code 7499011121A Design THT xBase-T 10/100 Base-T Ports 1x1 Application Standard Tab Position DOWN LED (Left-Right) Yellow-Green EMI Fingers Yes <http://katalog.we-online.de/media/images/eisos/UtLAN_RJ45_pf2.jpg> Details see: http://katalog.we-online.de/en/pbs/WE-LAN_RJ45/7499011121A? Updated by Dan Xu 2014-07-10 2014 (C) Würth Elektronik; COMPANY-URL: http://www.we-online.de; CREATED-BY: Christin Zierenner; CREATED-DATE: AUG 2012; DATASHEET-URL: http://katalog.we-online.de/kataloge/eisos/media/pdf/7499011121A.pdf; MANUFACTURER: Würth Elektronik eiSos GmbH
X23 = Cynara-Connectors:DEBUG-XILINX; MANUFACTURER: MOLEX; MANUFACTURERPARTNO: 87832-1420
X24 = Cynara-Connectors:DEBUG-CORTEXM10; MANUFACTURER: SAMTEC; MANUFACTURERPARTNO: 62101021021